# EAGLE schematic untitled (EAGLE 9.6.2)
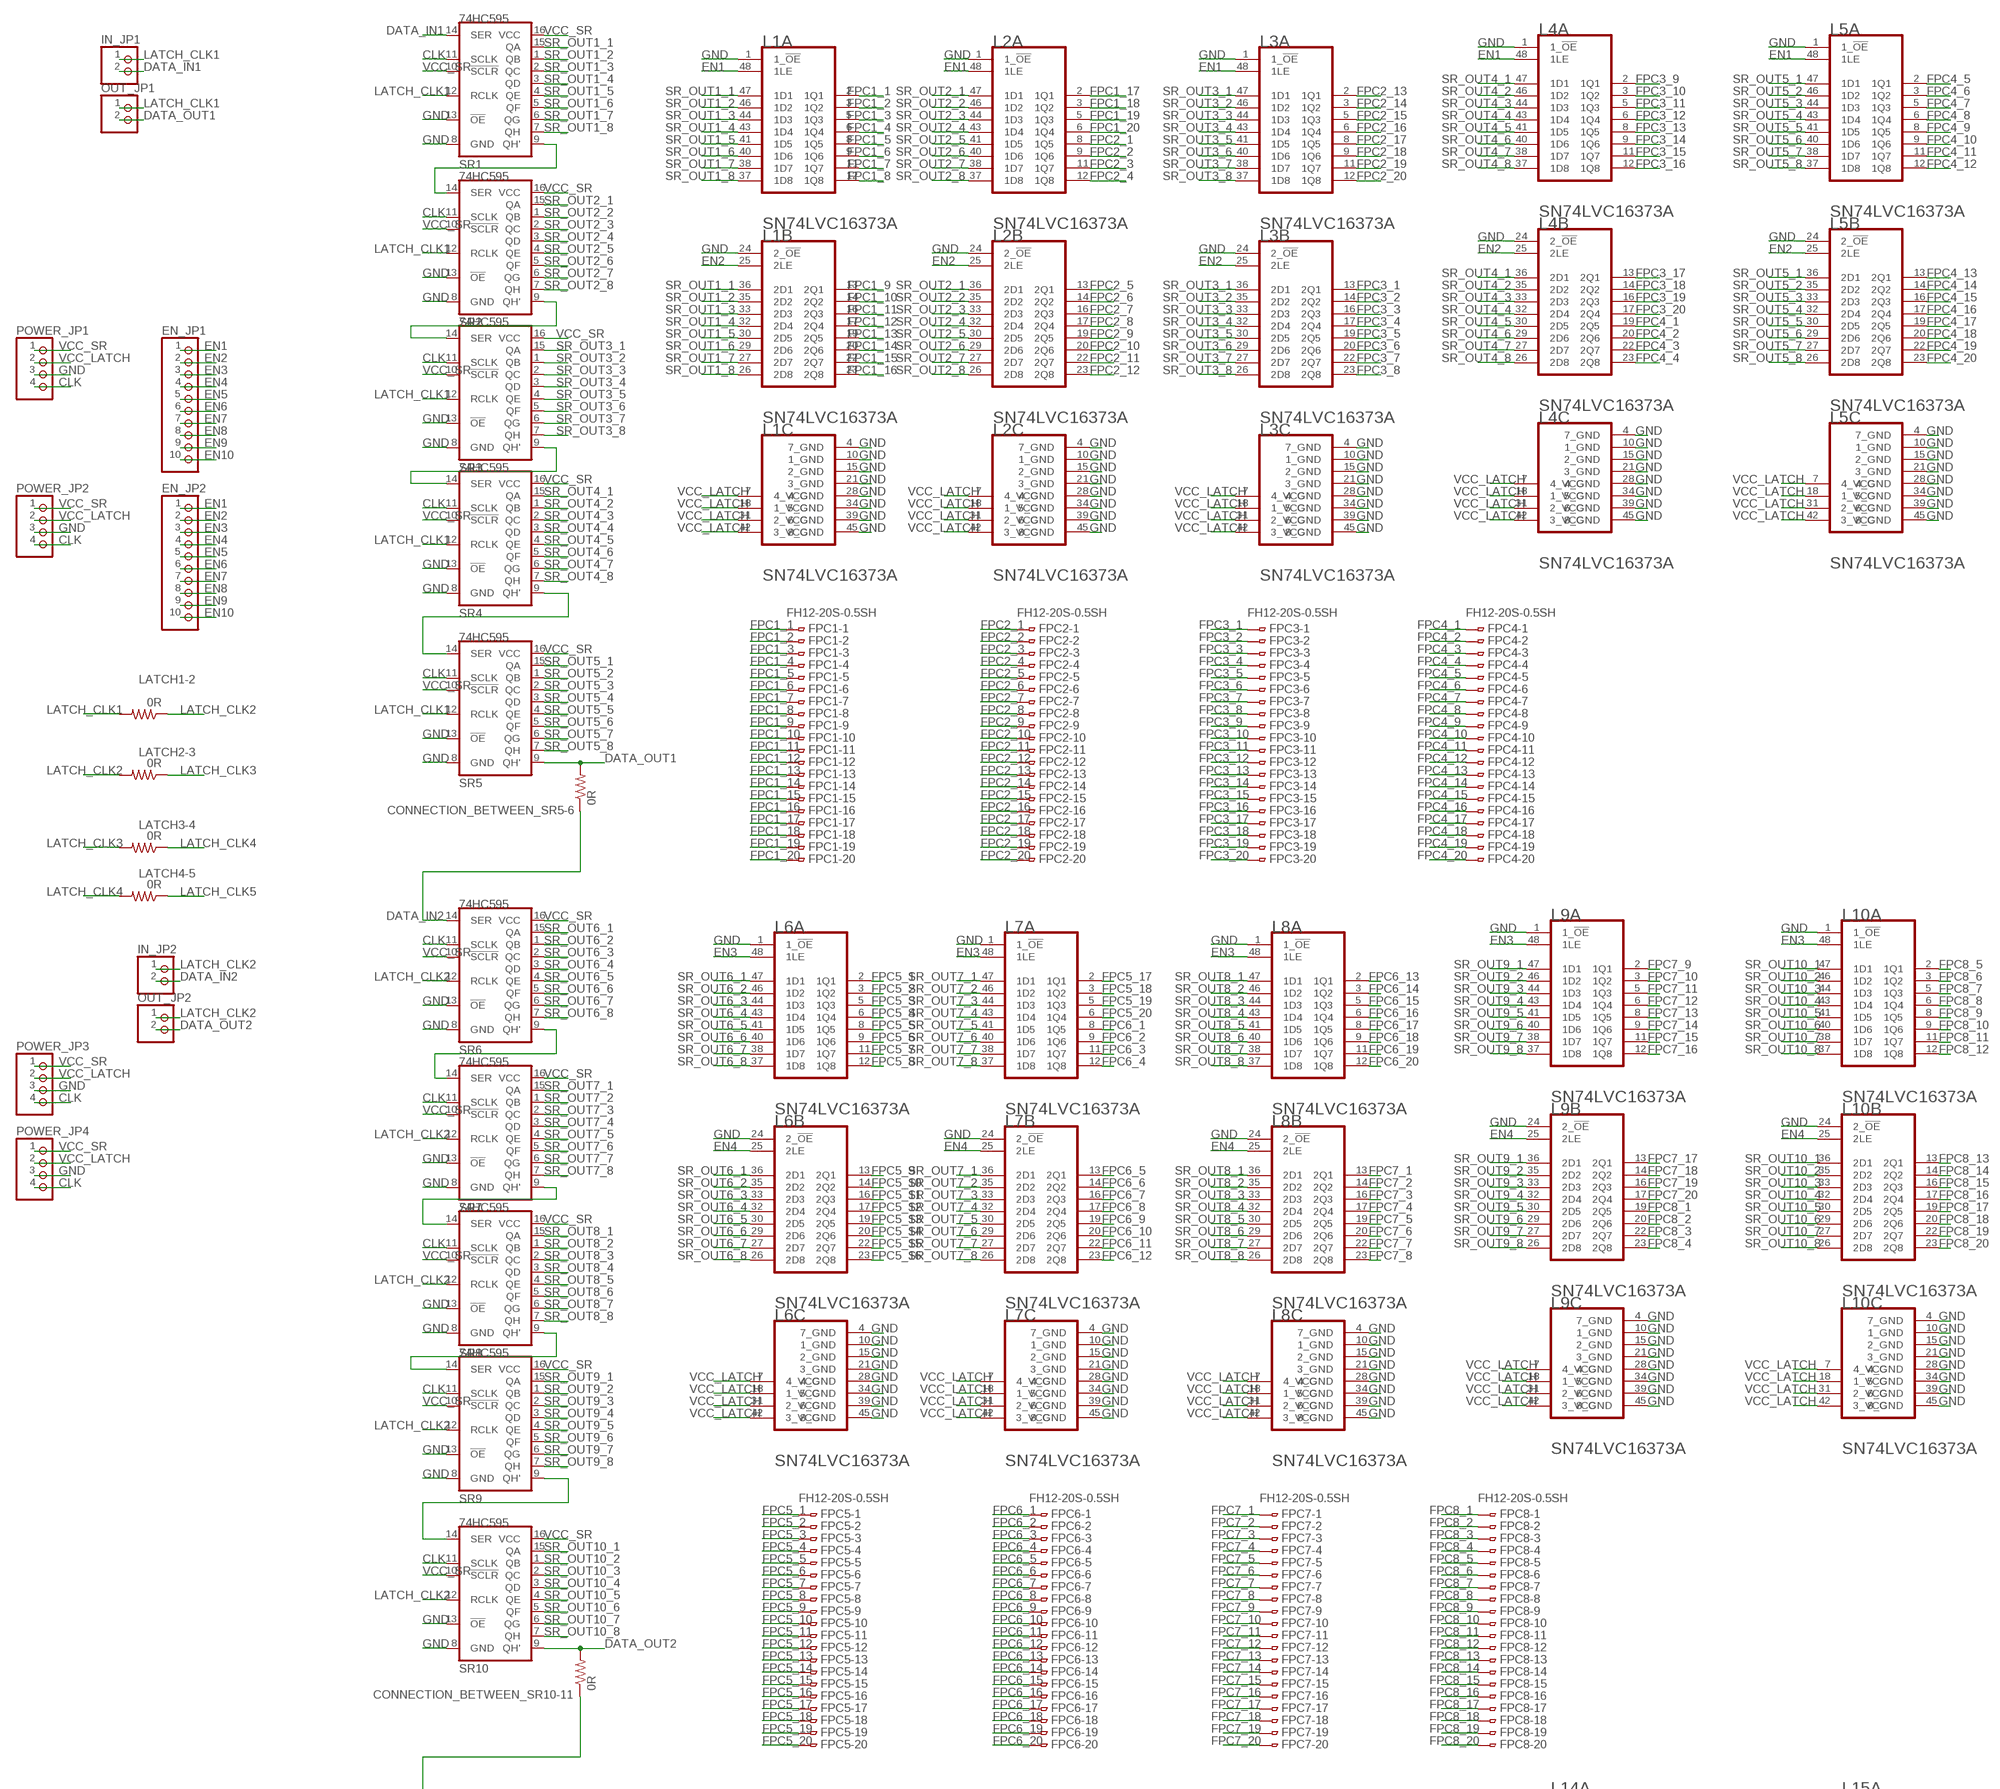
[diagram p0: schematic, sheet 1, part 1 of 3]
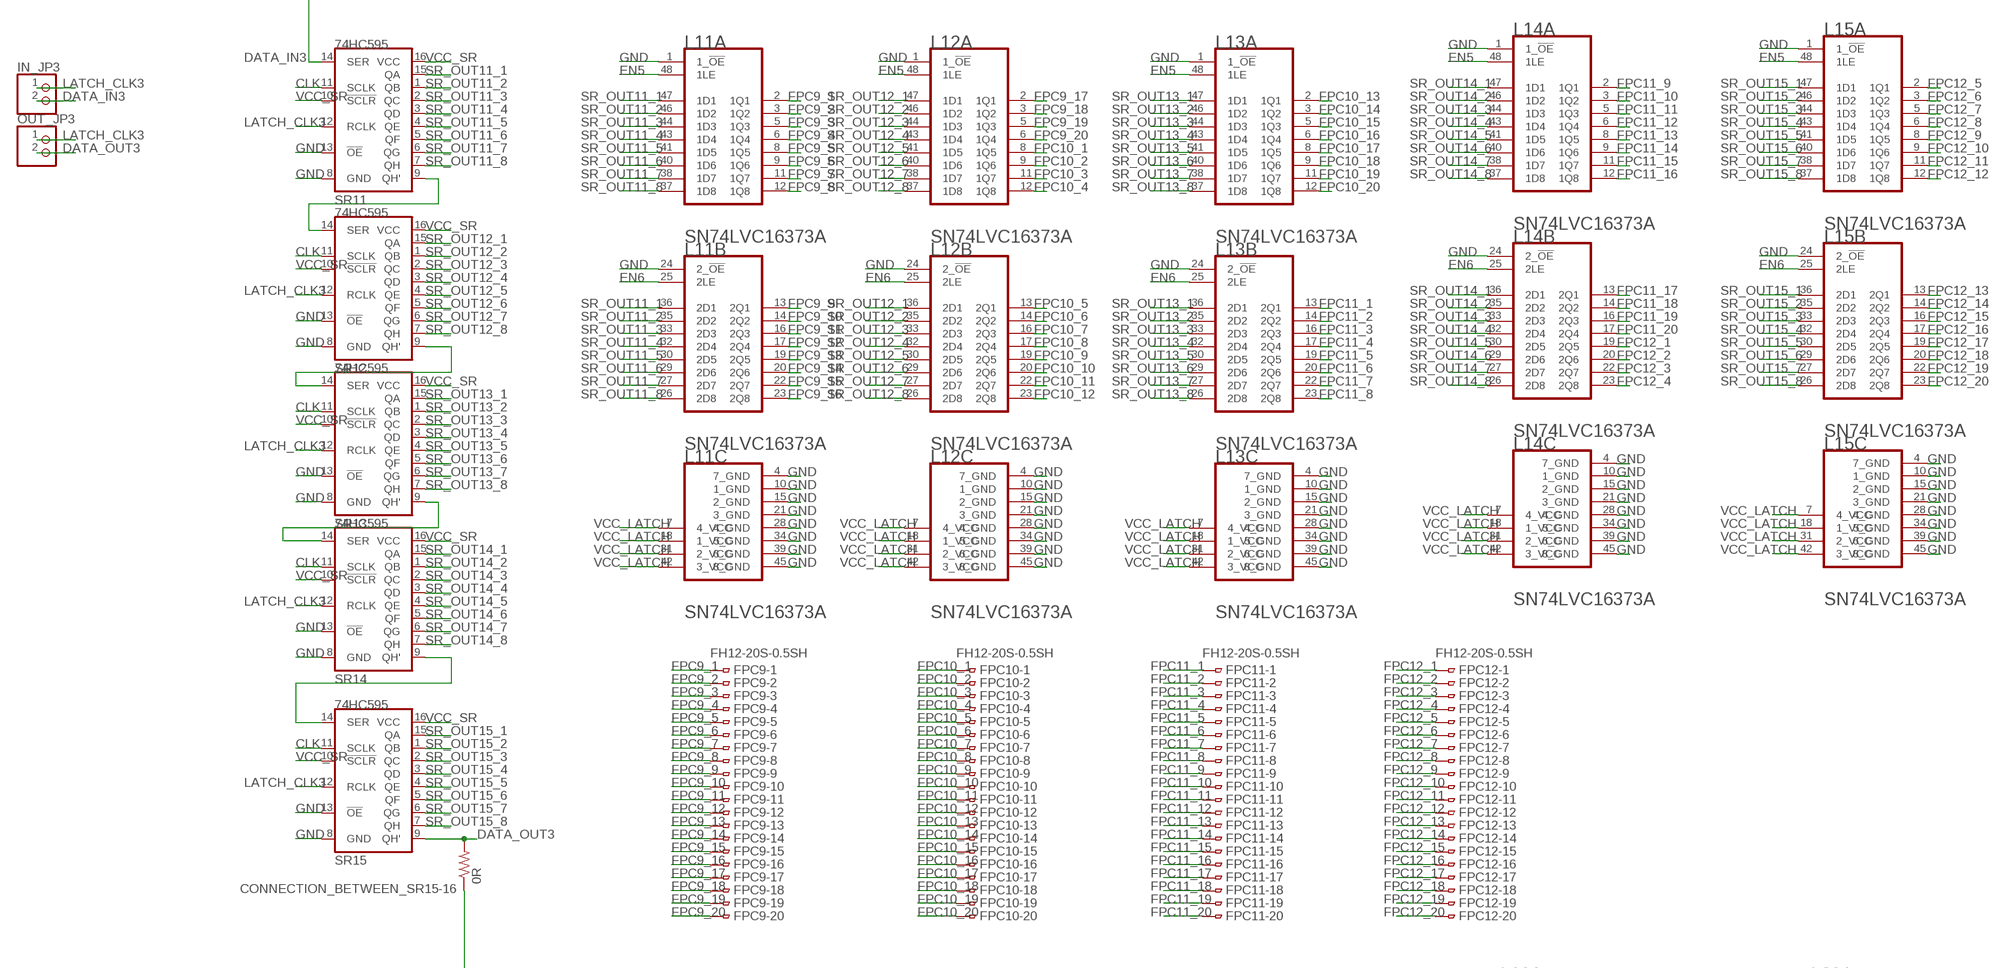
[diagram p1: schematic, sheet 1, part 2 of 3]
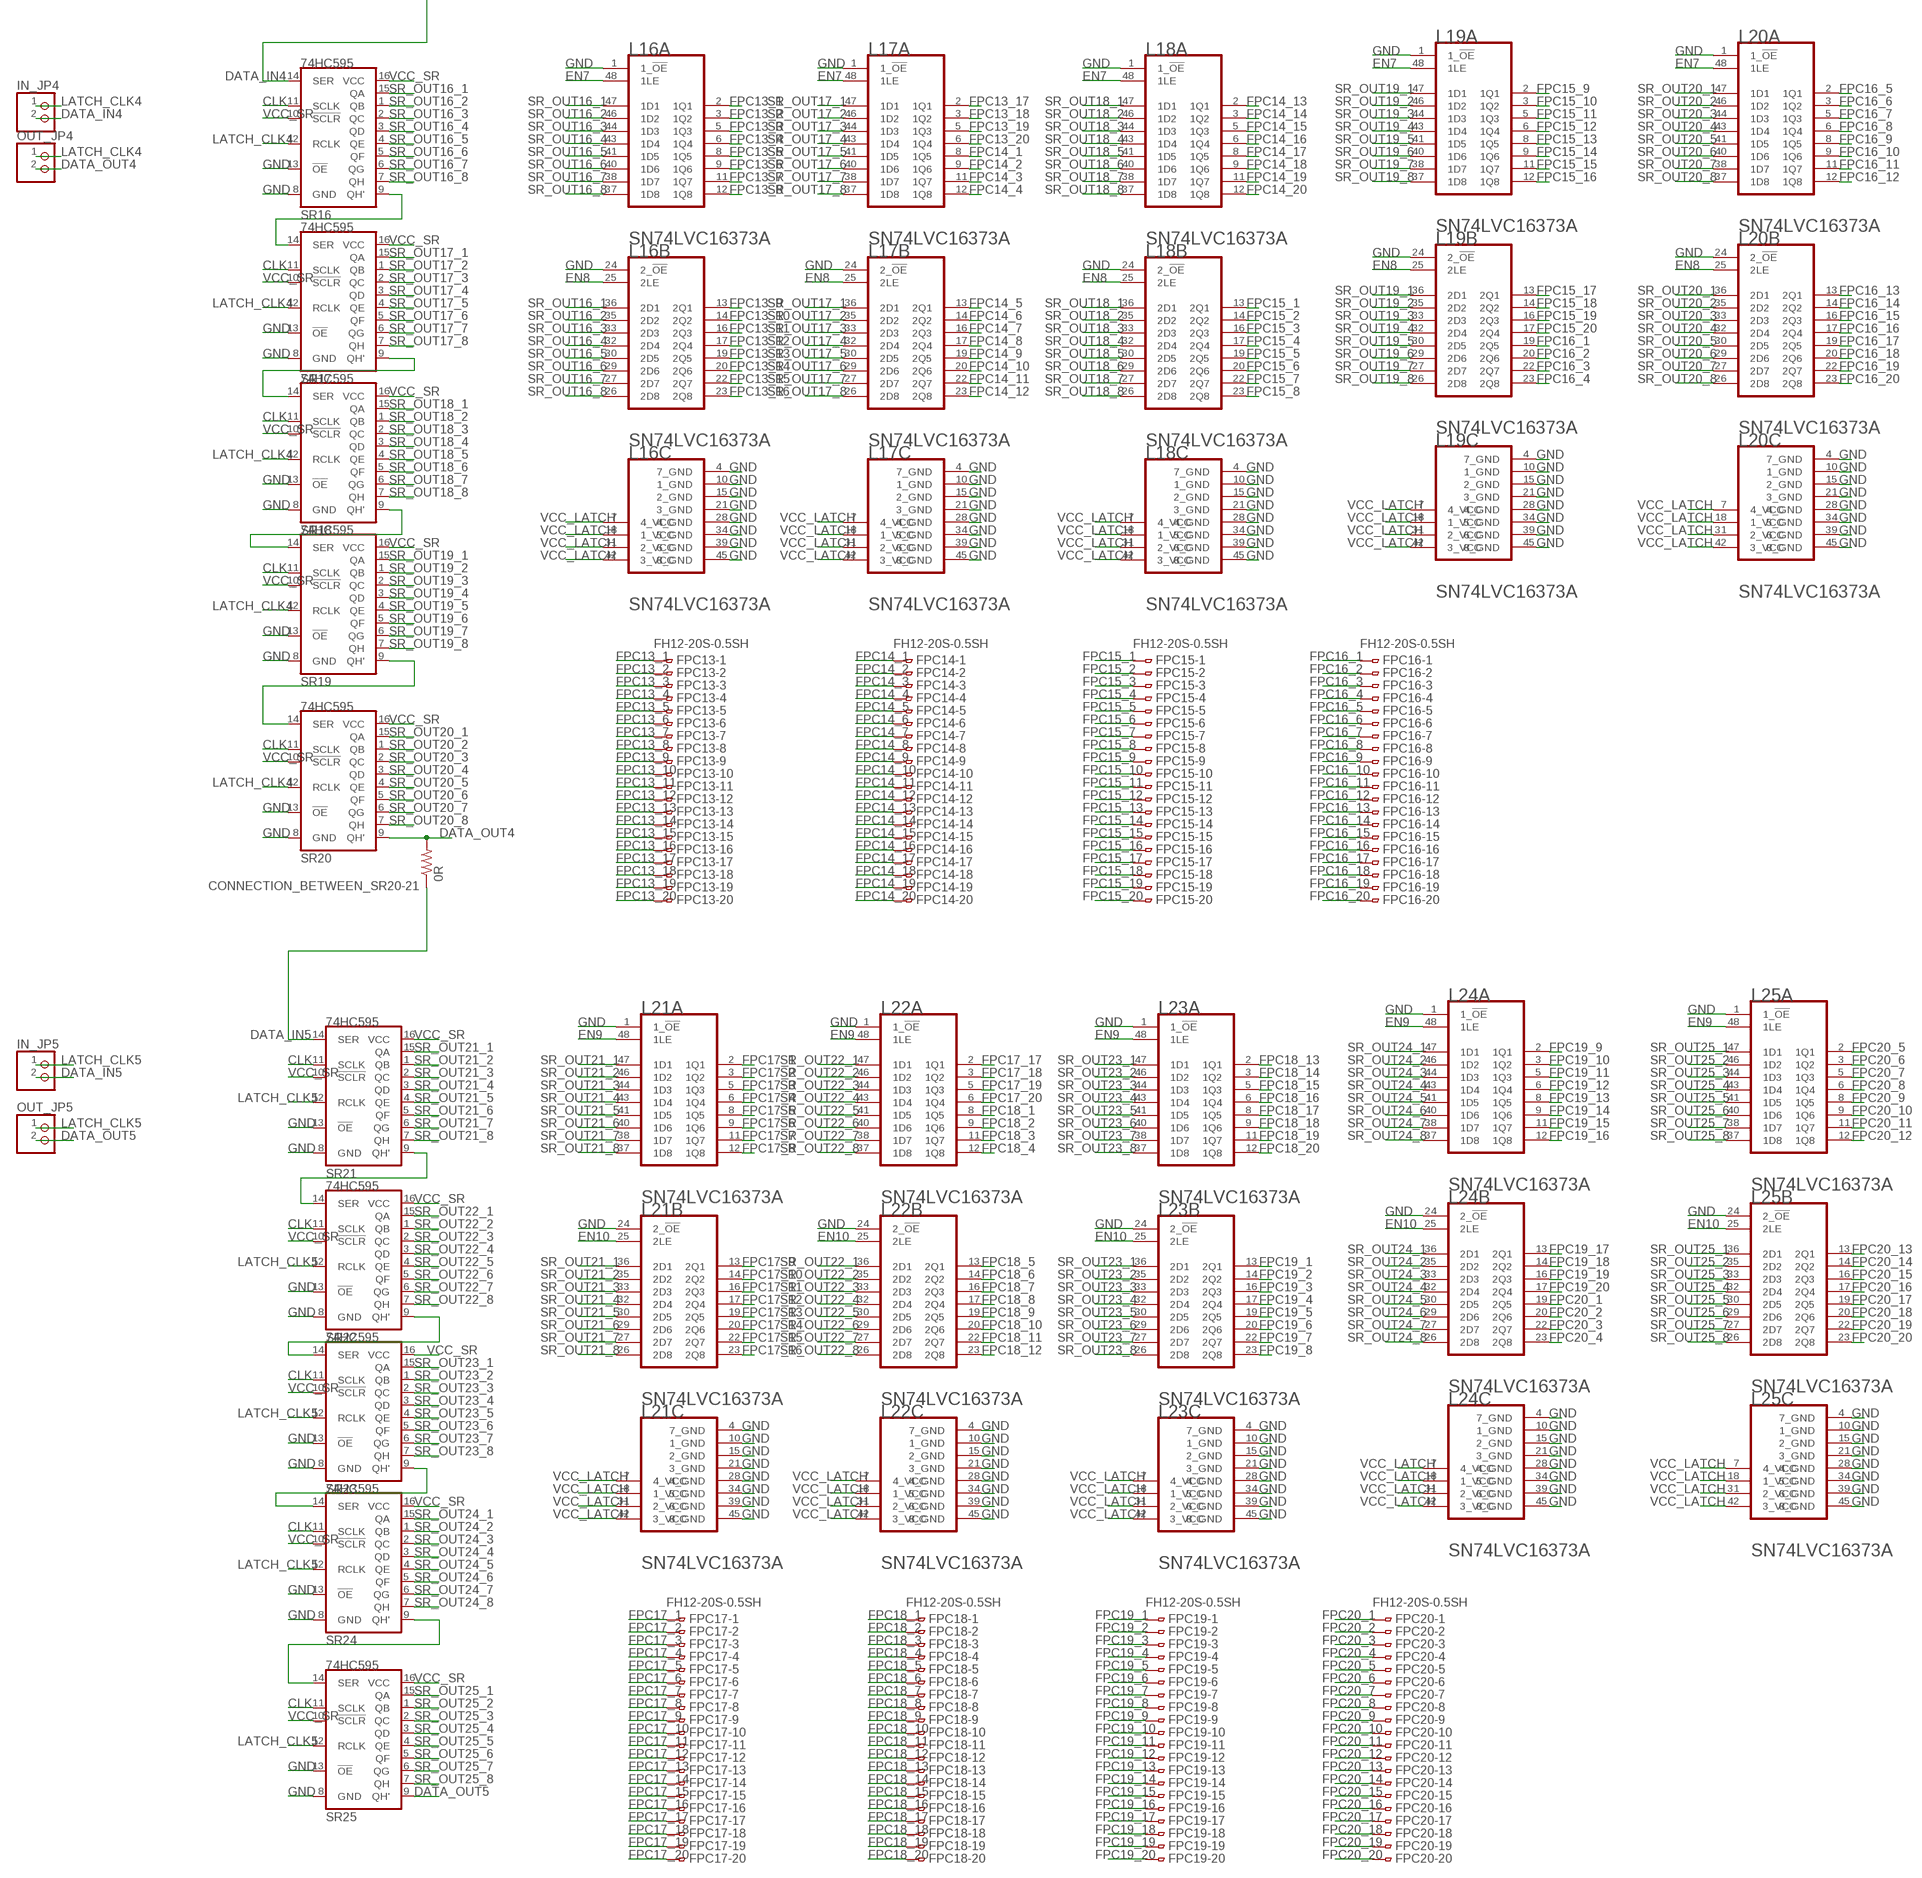
[diagram p2: schematic, sheet 1, part 3 of 3]

## Parts
CONNECTION_BETWEEN_SR5-6  0R  R-US_M0805  [M0805]
CONNECTION_BETWEEN_SR10-11  0R  R-US_M0805  [M0805]
CONNECTION_BETWEEN_SR15-16  0R  R-US_M0805  [M0805]
CONNECTION_BETWEEN_SR20-21  0R  R-US_M0805  [M0805]
EN_JP1  PINHD-1X10  [1X10]
EN_JP2  PINHD-1X10  [1X10]
FPC1  FH12-20S-0.5SH  [FH12-20S-0.5SH]
FPC2  FH12-20S-0.5SH  [FH12-20S-0.5SH]
FPC3  FH12-20S-0.5SH  [FH12-20S-0.5SH]
FPC4  FH12-20S-0.5SH  [FH12-20S-0.5SH]
FPC5  FH12-20S-0.5SH  [FH12-20S-0.5SH]
FPC6  FH12-20S-0.5SH  [FH12-20S-0.5SH]
FPC7  FH12-20S-0.5SH  [FH12-20S-0.5SH]
FPC8  FH12-20S-0.5SH  [FH12-20S-0.5SH]
FPC9  FH12-20S-0.5SH  [FH12-20S-0.5SH]
FPC10  FH12-20S-0.5SH  [FH12-20S-0.5SH]
FPC11  FH12-20S-0.5SH  [FH12-20S-0.5SH]
FPC12  FH12-20S-0.5SH  [FH12-20S-0.5SH]
FPC13  FH12-20S-0.5SH  [FH12-20S-0.5SH]
FPC14  FH12-20S-0.5SH  [FH12-20S-0.5SH]
FPC15  FH12-20S-0.5SH  [FH12-20S-0.5SH]
FPC16  FH12-20S-0.5SH  [FH12-20S-0.5SH]
FPC17  FH12-20S-0.5SH  [FH12-20S-0.5SH]
FPC18  FH12-20S-0.5SH  [FH12-20S-0.5SH]
FPC19  FH12-20S-0.5SH  [FH12-20S-0.5SH]
FPC20  FH12-20S-0.5SH  [FH12-20S-0.5SH]
IN_JP1  PINHD-1X2  [1X02]
IN_JP2  PINHD-1X2  [1X02]
IN_JP3  PINHD-1X2  [1X02]
IN_JP4  PINHD-1X2  [1X02]
IN_JP5  PINHD-1X2  [1X02]
L1  TEXAS_INSTRUMENTS_SN74LVC16373ATEXAS_INSTRUMENTS_SN74LVC16373A_0_2  [TEXAS_INSTRUMENTS_SN74LVC16373A_2]
L2  TEXAS_INSTRUMENTS_SN74LVC16373ATEXAS_INSTRUMENTS_SN74LVC16373A_0_2  [TEXAS_INSTRUMENTS_SN74LVC16373A_2]
L3  TEXAS_INSTRUMENTS_SN74LVC16373ATEXAS_INSTRUMENTS_SN74LVC16373A_0_2  [TEXAS_INSTRUMENTS_SN74LVC16373A_2]
L4  TEXAS_INSTRUMENTS_SN74LVC16373ATEXAS_INSTRUMENTS_SN74LVC16373A_0_2  [TEXAS_INSTRUMENTS_SN74LVC16373A_2]
L5  TEXAS_INSTRUMENTS_SN74LVC16373ATEXAS_INSTRUMENTS_SN74LVC16373A_0_2  [TEXAS_INSTRUMENTS_SN74LVC16373A_2]
L6  TEXAS_INSTRUMENTS_SN74LVC16373ATEXAS_INSTRUMENTS_SN74LVC16373A_0_2  [TEXAS_INSTRUMENTS_SN74LVC16373A_2]
L7  TEXAS_INSTRUMENTS_SN74LVC16373ATEXAS_INSTRUMENTS_SN74LVC16373A_0_2  [TEXAS_INSTRUMENTS_SN74LVC16373A_2]
L8  TEXAS_INSTRUMENTS_SN74LVC16373ATEXAS_INSTRUMENTS_SN74LVC16373A_0_2  [TEXAS_INSTRUMENTS_SN74LVC16373A_2]
L9  TEXAS_INSTRUMENTS_SN74LVC16373ATEXAS_INSTRUMENTS_SN74LVC16373A_0_2  [TEXAS_INSTRUMENTS_SN74LVC16373A_2]
L10  TEXAS_INSTRUMENTS_SN74LVC16373ATEXAS_INSTRUMENTS_SN74LVC16373A_0_2  [TEXAS_INSTRUMENTS_SN74LVC16373A_2]
L11  TEXAS_INSTRUMENTS_SN74LVC16373ATEXAS_INSTRUMENTS_SN74LVC16373A_0_2  [TEXAS_INSTRUMENTS_SN74LVC16373A_2]
L12  TEXAS_INSTRUMENTS_SN74LVC16373ATEXAS_INSTRUMENTS_SN74LVC16373A_0_2  [TEXAS_INSTRUMENTS_SN74LVC16373A_2]
L13  TEXAS_INSTRUMENTS_SN74LVC16373ATEXAS_INSTRUMENTS_SN74LVC16373A_0_2  [TEXAS_INSTRUMENTS_SN74LVC16373A_2]
L14  TEXAS_INSTRUMENTS_SN74LVC16373ATEXAS_INSTRUMENTS_SN74LVC16373A_0_2  [TEXAS_INSTRUMENTS_SN74LVC16373A_2]
L15  TEXAS_INSTRUMENTS_SN74LVC16373ATEXAS_INSTRUMENTS_SN74LVC16373A_0_2  [TEXAS_INSTRUMENTS_SN74LVC16373A_2]
L16  TEXAS_INSTRUMENTS_SN74LVC16373ATEXAS_INSTRUMENTS_SN74LVC16373A_0_2  [TEXAS_INSTRUMENTS_SN74LVC16373A_2]
L17  TEXAS_INSTRUMENTS_SN74LVC16373ATEXAS_INSTRUMENTS_SN74LVC16373A_0_2  [TEXAS_INSTRUMENTS_SN74LVC16373A_2]
L18  TEXAS_INSTRUMENTS_SN74LVC16373ATEXAS_INSTRUMENTS_SN74LVC16373A_0_2  [TEXAS_INSTRUMENTS_SN74LVC16373A_2]
L19  TEXAS_INSTRUMENTS_SN74LVC16373ATEXAS_INSTRUMENTS_SN74LVC16373A_0_2  [TEXAS_INSTRUMENTS_SN74LVC16373A_2]
L20  TEXAS_INSTRUMENTS_SN74LVC16373ATEXAS_INSTRUMENTS_SN74LVC16373A_0_2  [TEXAS_INSTRUMENTS_SN74LVC16373A_2]
L21  TEXAS_INSTRUMENTS_SN74LVC16373ATEXAS_INSTRUMENTS_SN74LVC16373A_0_2  [TEXAS_INSTRUMENTS_SN74LVC16373A_2]
L22  TEXAS_INSTRUMENTS_SN74LVC16373ATEXAS_INSTRUMENTS_SN74LVC16373A_0_2  [TEXAS_INSTRUMENTS_SN74LVC16373A_2]
L23  TEXAS_INSTRUMENTS_SN74LVC16373ATEXAS_INSTRUMENTS_SN74LVC16373A_0_2  [TEXAS_INSTRUMENTS_SN74LVC16373A_2]
L24  TEXAS_INSTRUMENTS_SN74LVC16373ATEXAS_INSTRUMENTS_SN74LVC16373A_0_2  [TEXAS_INSTRUMENTS_SN74LVC16373A_2]
L25  TEXAS_INSTRUMENTS_SN74LVC16373ATEXAS_INSTRUMENTS_SN74LVC16373A_0_2  [TEXAS_INSTRUMENTS_SN74LVC16373A_2]
LATCH1-2  0R  R-US_M0805  [M0805]
LATCH2-3  0R  R-US_M0805  [M0805]
LATCH3-4  0R  R-US_M0805  [M0805]
LATCH4-5  0R  R-US_M0805  [M0805]
OUT_JP1  PINHD-1X2  [1X02]
OUT_JP2  PINHD-1X2  [1X02]
OUT_JP3  PINHD-1X2  [1X02]
OUT_JP4  PINHD-1X2  [1X02]
OUT_JP5  PINHD-1X2  [1X02]
POWER_JP1  PINHD-1X4  [1X04]
POWER_JP2  PINHD-1X4  [1X04]
POWER_JP3  PINHD-1X4  [1X04]
POWER_JP4  PINHD-1X4  [1X04]
SR1  74HC595  [SO16]
SR2  74HC595  [SO16]
SR3  74HC595  [SO16]
SR4  74HC595  [SO16]
SR5  74HC595  [SO16]
SR6  74HC595  [SO16]
SR7  74HC595  [SO16]
SR8  74HC595  [SO16]
SR9  74HC595  [SO16]
SR10  74HC595  [SO16]
SR11  74HC595  [SO16]
SR12  74HC595  [SO16]
SR13  74HC595  [SO16]
SR14  74HC595  [SO16]
SR15  74HC595  [SO16]
SR16  74HC595  [SO16]
SR17  74HC595  [SO16]
SR18  74HC595  [SO16]
SR19  74HC595  [SO16]
SR20  74HC595  [SO16]
SR21  74HC595  [SO16]
SR22  74HC595  [SO16]
SR23  74HC595  [SO16]
SR24  74HC595  [SO16]
SR25  74HC595  [SO16]

## Nets
CLK: POWER_JP1.4 POWER_JP2.4 POWER_JP3.4 POWER_JP4.4 SR1.11(SCLK) SR2.11(SCLK) SR3.11(SCLK) SR4.11(SCLK) SR5.11(SCLK) SR6.11(SCLK) SR7.11(SCLK) SR8.11(SCLK) SR9.11(SCLK) SR10.11(SCLK) SR11.11(SCLK) SR12.11(SCLK) SR13.11(SCLK) SR14.11(SCLK) SR15.11(SCLK) SR16.11(SCLK) SR17.11(SCLK) SR18.11(SCLK) SR19.11(SCLK) SR20.11(SCLK) SR21.11(SCLK) SR22.11(SCLK) SR23.11(SCLK) SR24.11(SCLK) SR25.11(SCLK)
DATA_IN1: IN_JP1.2 SR1.14(SER)
DATA_IN2: CONNECTION_BETWEEN_SR5-6.1 IN_JP2.2 SR6.14(SER)
DATA_IN3: CONNECTION_BETWEEN_SR10-11.1 IN_JP3.2 SR11.14(SER)
DATA_IN4: CONNECTION_BETWEEN_SR15-16.1 IN_JP4.2 SR16.14(SER)
DATA_IN5: CONNECTION_BETWEEN_SR20-21.1 IN_JP5.2 SR21.14(SER)
DATA_OUT1: CONNECTION_BETWEEN_SR5-6.2 OUT_JP1.2 SR5.9(QH')
DATA_OUT2: CONNECTION_BETWEEN_SR10-11.2 OUT_JP2.2 SR10.9(QH')
DATA_OUT3: CONNECTION_BETWEEN_SR15-16.2 OUT_JP3.2 SR15.9(QH')
DATA_OUT4: CONNECTION_BETWEEN_SR20-21.2 OUT_JP4.2 SR20.9(QH')
DATA_OUT5: OUT_JP5.2 SR25.9(QH')
EN1: EN_JP1.1 EN_JP2.1 L1.48(A:1LE) L2.48(A:1LE) L3.48(A:1LE) L4.48(A:1LE) L5.48(A:1LE)
EN2: EN_JP1.2 EN_JP2.2 L1.25(B:2LE) L2.25(B:2LE) L3.25(B:2LE) L4.25(B:2LE) L5.25(B:2LE)
EN3: EN_JP1.3 EN_JP2.3 L6.48(A:1LE) L7.48(A:1LE) L8.48(A:1LE) L9.48(A:1LE) L10.48(A:1LE)
EN4: EN_JP1.4 EN_JP2.4 L6.25(B:2LE) L7.25(B:2LE) L8.25(B:2LE) L9.25(B:2LE) L10.25(B:2LE)
EN5: EN_JP1.5 EN_JP2.5 L11.48(A:1LE) L12.48(A:1LE) L13.48(A:1LE) L14.48(A:1LE) L15.48(A:1LE)
EN6: EN_JP1.6 EN_JP2.6 L11.25(B:2LE) L12.25(B:2LE) L13.25(B:2LE) L14.25(B:2LE) L15.25(B:2LE)
EN7: EN_JP1.7 EN_JP2.7 L16.48(A:1LE) L17.48(A:1LE) L18.48(A:1LE) L19.48(A:1LE) L20.48(A:1LE)
EN8: EN_JP1.8 EN_JP2.8 L16.25(B:2LE) L17.25(B:2LE) L18.25(B:2LE) L19.25(B:2LE) L20.25(B:2LE)
EN9: EN_JP1.9 EN_JP2.9 L21.48(A:1LE) L22.48(A:1LE) L23.48(A:1LE) L24.48(A:1LE) L25.48(A:1LE)
EN10: EN_JP1.10 EN_JP2.10 L21.25(B:2LE) L22.25(B:2LE) L23.25(B:2LE) L24.25(B:2LE) L25.25(B:2LE)
FPC1_1: FPC1.1 L1.2(A:1Q1)
FPC1_2: FPC1.2 L1.3(A:1Q2)
FPC1_3: FPC1.3 L1.5(A:1Q3)
FPC1_4: FPC1.4 L1.6(A:1Q4)
FPC1_5: FPC1.5 L1.8(A:1Q5)
FPC1_6: FPC1.6 L1.9(A:1Q6)
FPC1_7: FPC1.7 L1.11(A:1Q7)
FPC1_8: FPC1.8 L1.12(A:1Q8)
FPC1_9: FPC1.9 L1.13(B:2Q1)
FPC1_10: FPC1.10 L1.14(B:2Q2)
FPC1_11: FPC1.11 L1.16(B:2Q3)
FPC1_12: FPC1.12 L1.17(B:2Q4)
FPC1_13: FPC1.13 L1.19(B:2Q5)
FPC1_14: FPC1.14 L1.20(B:2Q6)
FPC1_15: FPC1.15 L1.22(B:2Q7)
FPC1_16: FPC1.16 L1.23(B:2Q8)
FPC1_17: FPC1.17 L2.2(A:1Q1)
FPC1_18: FPC1.18 L2.3(A:1Q2)
FPC1_19: FPC1.19 L2.5(A:1Q3)
FPC1_20: FPC1.20 L2.6(A:1Q4)
FPC2_1: FPC2.1 L2.8(A:1Q5)
FPC2_2: FPC2.2 L2.9(A:1Q6)
FPC2_3: FPC2.3 L2.11(A:1Q7)
FPC2_4: FPC2.4 L2.12(A:1Q8)
FPC2_5: FPC2.5 L2.13(B:2Q1)
FPC2_6: FPC2.6 L2.14(B:2Q2)
FPC2_7: FPC2.7 L2.16(B:2Q3)
FPC2_8: FPC2.8 L2.17(B:2Q4)
FPC2_9: FPC2.9 L2.19(B:2Q5)
FPC2_10: FPC2.10 L2.20(B:2Q6)
FPC2_11: FPC2.11 L2.22(B:2Q7)
FPC2_12: FPC2.12 L2.23(B:2Q8)
FPC2_13: FPC2.13 L3.2(A:1Q1)
FPC2_14: FPC2.14 L3.3(A:1Q2)
FPC2_15: FPC2.15 L3.5(A:1Q3)
FPC2_16: FPC2.16 L3.6(A:1Q4)
FPC2_17: FPC2.17 L3.8(A:1Q5)
FPC2_18: FPC2.18 L3.9(A:1Q6)
FPC2_19: FPC2.19 L3.11(A:1Q7)
FPC2_20: FPC2.20 L3.12(A:1Q8)
FPC3_1: FPC3.1 L3.13(B:2Q1)
FPC3_2: FPC3.2 L3.14(B:2Q2)
FPC3_3: FPC3.3 L3.16(B:2Q3)
FPC3_4: FPC3.4 L3.17(B:2Q4)
FPC3_5: FPC3.5 L3.19(B:2Q5)
FPC3_6: FPC3.6 L3.20(B:2Q6)
FPC3_7: FPC3.7 L3.22(B:2Q7)
FPC3_8: FPC3.8 L3.23(B:2Q8)
FPC3_9: FPC3.9 L4.2(A:1Q1)
FPC3_10: FPC3.10 L4.3(A:1Q2)
FPC3_11: FPC3.11 L4.5(A:1Q3)
FPC3_12: FPC3.12 L4.6(A:1Q4)
FPC3_13: FPC3.13 L4.8(A:1Q5)
FPC3_14: FPC3.14 L4.9(A:1Q6)
FPC3_15: FPC3.15 L4.11(A:1Q7)
FPC3_16: FPC3.16 L4.12(A:1Q8)
FPC3_17: FPC3.17 L4.13(B:2Q1)
FPC3_18: FPC3.18 L4.14(B:2Q2)
FPC3_19: FPC3.19 L4.16(B:2Q3)
FPC3_20: FPC3.20 L4.17(B:2Q4)
FPC4_1: FPC4.1 L4.19(B:2Q5)
FPC4_2: FPC4.2 L4.20(B:2Q6)
FPC4_3: FPC4.3 L4.22(B:2Q7)
FPC4_4: FPC4.4 L4.23(B:2Q8)
FPC4_5: FPC4.5 L5.2(A:1Q1)
FPC4_6: FPC4.6 L5.3(A:1Q2)
FPC4_7: FPC4.7 L5.5(A:1Q3)
FPC4_8: FPC4.8 L5.6(A:1Q4)
FPC4_9: FPC4.9 L5.8(A:1Q5)
FPC4_10: FPC4.10 L5.9(A:1Q6)
FPC4_11: FPC4.11 L5.11(A:1Q7)
FPC4_12: FPC4.12 L5.12(A:1Q8)
FPC4_13: FPC4.13 L5.13(B:2Q1)
FPC4_14: FPC4.14 L5.14(B:2Q2)
FPC4_15: FPC4.15 L5.16(B:2Q3)
FPC4_16: FPC4.16 L5.17(B:2Q4)
FPC4_17: FPC4.17 L5.19(B:2Q5)
FPC4_18: FPC4.18 L5.20(B:2Q6)
FPC4_19: FPC4.19 L5.22(B:2Q7)
FPC4_20: FPC4.20 L5.23(B:2Q8)
FPC5_1: FPC5.1 L6.2(A:1Q1)
FPC5_2: FPC5.2 L6.3(A:1Q2)
FPC5_3: FPC5.3 L6.5(A:1Q3)
FPC5_4: FPC5.4 L6.6(A:1Q4)
FPC5_5: FPC5.5 L6.8(A:1Q5)
FPC5_6: FPC5.6 L6.9(A:1Q6)
FPC5_7: FPC5.7 L6.11(A:1Q7)
FPC5_8: FPC5.8 L6.12(A:1Q8)
FPC5_9: FPC5.9 L6.13(B:2Q1)
FPC5_10: FPC5.10 L6.14(B:2Q2)
FPC5_11: FPC5.11 L6.16(B:2Q3)
FPC5_12: FPC5.12 L6.17(B:2Q4)
FPC5_13: FPC5.13 L6.19(B:2Q5)
FPC5_14: FPC5.14 L6.20(B:2Q6)
FPC5_15: FPC5.15 L6.22(B:2Q7)
FPC5_16: FPC5.16 L6.23(B:2Q8)
FPC5_17: FPC5.17 L7.2(A:1Q1)
FPC5_18: FPC5.18 L7.3(A:1Q2)
FPC5_19: FPC5.19 L7.5(A:1Q3)
FPC5_20: FPC5.20 L7.6(A:1Q4)
FPC6_1: FPC6.1 L7.8(A:1Q5)
FPC6_2: FPC6.2 L7.9(A:1Q6)
FPC6_3: FPC6.3 L7.11(A:1Q7)
FPC6_4: FPC6.4 L7.12(A:1Q8)
FPC6_5: FPC6.5 L7.13(B:2Q1)
FPC6_6: FPC6.6 L7.14(B:2Q2)
FPC6_7: FPC6.7 L7.16(B:2Q3)
FPC6_8: FPC6.8 L7.17(B:2Q4)
FPC6_9: FPC6.9 L7.19(B:2Q5)
FPC6_10: FPC6.10 L7.20(B:2Q6)
FPC6_11: FPC6.11 L7.22(B:2Q7)
FPC6_12: FPC6.12 L7.23(B:2Q8)
FPC6_13: FPC6.13 L8.2(A:1Q1)
FPC6_14: FPC6.14 L8.3(A:1Q2)
FPC6_15: FPC6.15 L8.5(A:1Q3)
FPC6_16: FPC6.16 L8.6(A:1Q4)
FPC6_17: FPC6.17 L8.8(A:1Q5)
FPC6_18: FPC6.18 L8.9(A:1Q6)
FPC6_19: FPC6.19 L8.11(A:1Q7)
FPC6_20: FPC6.20 L8.12(A:1Q8)
FPC7_1: FPC7.1 L8.13(B:2Q1)
FPC7_2: FPC7.2 L8.14(B:2Q2)
FPC7_3: FPC7.3 L8.16(B:2Q3)
FPC7_4: FPC7.4 L8.17(B:2Q4)
FPC7_5: FPC7.5 L8.19(B:2Q5)
FPC7_6: FPC7.6 L8.20(B:2Q6)
FPC7_7: FPC7.7 L8.22(B:2Q7)
FPC7_8: FPC7.8 L8.23(B:2Q8)
FPC7_9: FPC7.9 L9.2(A:1Q1)
FPC7_10: FPC7.10 L9.3(A:1Q2)
FPC7_11: FPC7.11 L9.5(A:1Q3)
FPC7_12: FPC7.12 L9.6(A:1Q4)
FPC7_13: FPC7.13 L9.8(A:1Q5)
FPC7_14: FPC7.14 L9.9(A:1Q6)
FPC7_15: FPC7.15 L9.11(A:1Q7)
FPC7_16: FPC7.16 L9.12(A:1Q8)
FPC7_17: FPC7.17 L9.13(B:2Q1)
FPC7_18: FPC7.18 L9.14(B:2Q2)
FPC7_19: FPC7.19 L9.16(B:2Q3)
FPC7_20: FPC7.20 L9.17(B:2Q4)
FPC8_1: FPC8.1 L9.19(B:2Q5)
FPC8_2: FPC8.2 L9.20(B:2Q6)
FPC8_3: FPC8.3 L9.22(B:2Q7)
FPC8_4: FPC8.4 L9.23(B:2Q8)
FPC8_5: FPC8.5 L10.2(A:1Q1)
FPC8_6: FPC8.6 L10.3(A:1Q2)
FPC8_7: FPC8.7 L10.5(A:1Q3)
FPC8_8: FPC8.8 L10.6(A:1Q4)
FPC8_9: FPC8.9 L10.8(A:1Q5)
FPC8_10: FPC8.10 L10.9(A:1Q6)
FPC8_11: FPC8.11 L10.11(A:1Q7)
FPC8_12: FPC8.12 L10.12(A:1Q8)
FPC8_13: FPC8.13 L10.13(B:2Q1)
FPC8_14: FPC8.14 L10.14(B:2Q2)
FPC8_15: FPC8.15 L10.16(B:2Q3)
FPC8_16: FPC8.16 L10.17(B:2Q4)
FPC8_17: FPC8.17 L10.19(B:2Q5)
FPC8_18: FPC8.18 L10.20(B:2Q6)
FPC8_19: FPC8.19 L10.22(B:2Q7)
FPC8_20: FPC8.20 L10.23(B:2Q8)
FPC9_1: FPC9.1 L11.2(A:1Q1)
FPC9_2: FPC9.2 L11.3(A:1Q2)
FPC9_3: FPC9.3 L11.5(A:1Q3)
FPC9_4: FPC9.4 L11.6(A:1Q4)
FPC9_5: FPC9.5 L11.8(A:1Q5)
FPC9_6: FPC9.6 L11.9(A:1Q6)
FPC9_7: FPC9.7 L11.11(A:1Q7)
FPC9_8: FPC9.8 L11.12(A:1Q8)
FPC9_9: FPC9.9 L11.13(B:2Q1)
FPC9_10: FPC9.10 L11.14(B:2Q2)
FPC9_11: FPC9.11 L11.16(B:2Q3)
FPC9_12: FPC9.12 L11.17(B:2Q4)
FPC9_13: FPC9.13 L11.19(B:2Q5)
FPC9_14: FPC9.14 L11.20(B:2Q6)
FPC9_15: FPC9.15 L11.22(B:2Q7)
FPC9_16: FPC9.16 L11.23(B:2Q8)
FPC9_17: FPC9.17 L12.2(A:1Q1)
FPC9_18: FPC9.18 L12.3(A:1Q2)
FPC9_19: FPC9.19 L12.5(A:1Q3)
FPC9_20: FPC9.20 L12.6(A:1Q4)
FPC10_1: FPC10.1 L12.8(A:1Q5)
FPC10_2: FPC10.2 L12.9(A:1Q6)
FPC10_3: FPC10.3 L12.11(A:1Q7)
FPC10_4: FPC10.4 L12.12(A:1Q8)
FPC10_5: FPC10.5 L12.13(B:2Q1)
FPC10_6: FPC10.6 L12.14(B:2Q2)
FPC10_7: FPC10.7 L12.16(B:2Q3)
FPC10_8: FPC10.8 L12.17(B:2Q4)
FPC10_9: FPC10.9 L12.19(B:2Q5)
FPC10_10: FPC10.10 L12.20(B:2Q6)
FPC10_11: FPC10.11 L12.22(B:2Q7)
FPC10_12: FPC10.12 L12.23(B:2Q8)
FPC10_13: FPC10.13 L13.2(A:1Q1)
FPC10_14: FPC10.14 L13.3(A:1Q2)
FPC10_15: FPC10.15 L13.5(A:1Q3)
FPC10_16: FPC10.16 L13.6(A:1Q4)
FPC10_17: FPC10.17 L13.8(A:1Q5)
FPC10_18: FPC10.18 L13.9(A:1Q6)
FPC10_19: FPC10.19 L13.11(A:1Q7)
FPC10_20: FPC10.20 L13.12(A:1Q8)
FPC11_1: FPC11.1 L13.13(B:2Q1)
FPC11_2: FPC11.2 L13.14(B:2Q2)
FPC11_3: FPC11.3 L13.16(B:2Q3)
FPC11_4: FPC11.4 L13.17(B:2Q4)
FPC11_5: FPC11.5 L13.19(B:2Q5)
FPC11_6: FPC11.6 L13.20(B:2Q6)
FPC11_7: FPC11.7 L13.22(B:2Q7)
FPC11_8: FPC11.8 L13.23(B:2Q8)
FPC11_9: FPC11.9 L14.2(A:1Q1)
FPC11_10: FPC11.10 L14.3(A:1Q2)
FPC11_11: FPC11.11 L14.5(A:1Q3)
FPC11_12: FPC11.12 L14.6(A:1Q4)
FPC11_13: FPC11.13 L14.8(A:1Q5)
FPC11_14: FPC11.14 L14.9(A:1Q6)
FPC11_15: FPC11.15 L14.11(A:1Q7)
FPC11_16: FPC11.16 L14.12(A:1Q8)
FPC11_17: FPC11.17 L14.13(B:2Q1)
FPC11_18: FPC11.18 L14.14(B:2Q2)
FPC11_19: FPC11.19 L14.16(B:2Q3)
FPC11_20: FPC11.20 L14.17(B:2Q4)
FPC12_1: FPC12.1 L14.19(B:2Q5)
FPC12_2: FPC12.2 L14.20(B:2Q6)
FPC12_3: FPC12.3 L14.22(B:2Q7)
FPC12_4: FPC12.4 L14.23(B:2Q8)
FPC12_5: FPC12.5 L15.2(A:1Q1)
FPC12_6: FPC12.6 L15.3(A:1Q2)
FPC12_7: FPC12.7 L15.5(A:1Q3)
FPC12_8: FPC12.8 L15.6(A:1Q4)
FPC12_9: FPC12.9 L15.8(A:1Q5)
FPC12_10: FPC12.10 L15.9(A:1Q6)
FPC12_11: FPC12.11 L15.11(A:1Q7)
FPC12_12: FPC12.12 L15.12(A:1Q8)
FPC12_13: FPC12.13 L15.13(B:2Q1)
FPC12_14: FPC12.14 L15.14(B:2Q2)
FPC12_15: FPC12.15 L15.16(B:2Q3)
FPC12_16: FPC12.16 L15.17(B:2Q4)
FPC12_17: FPC12.17 L15.19(B:2Q5)
FPC12_18: FPC12.18 L15.20(B:2Q6)
FPC12_19: FPC12.19 L15.22(B:2Q7)
FPC12_20: FPC12.20 L15.23(B:2Q8)
FPC13_1: FPC13.1 L16.2(A:1Q1)
FPC13_2: FPC13.2 L16.3(A:1Q2)
FPC13_3: FPC13.3 L16.5(A:1Q3)
FPC13_4: FPC13.4 L16.6(A:1Q4)
FPC13_5: FPC13.5 L16.8(A:1Q5)
FPC13_6: FPC13.6 L16.9(A:1Q6)
FPC13_7: FPC13.7 L16.11(A:1Q7)
FPC13_8: FPC13.8 L16.12(A:1Q8)
FPC13_9: FPC13.9 L16.13(B:2Q1)
FPC13_10: FPC13.10 L16.14(B:2Q2)
FPC13_11: FPC13.11 L16.16(B:2Q3)
FPC13_12: FPC13.12 L16.17(B:2Q4)
FPC13_13: FPC13.13 L16.19(B:2Q5)
FPC13_14: FPC13.14 L16.20(B:2Q6)
FPC13_15: FPC13.15 L16.22(B:2Q7)
FPC13_16: FPC13.16 L16.23(B:2Q8)
FPC13_17: FPC13.17 L17.2(A:1Q1)
FPC13_18: FPC13.18 L17.3(A:1Q2)
FPC13_19: FPC13.19 L17.5(A:1Q3)
FPC13_20: FPC13.20 L17.6(A:1Q4)
FPC14_1: FPC14.1 L17.8(A:1Q5)
FPC14_2: FPC14.2 L17.9(A:1Q6)
FPC14_3: FPC14.3 L17.11(A:1Q7)
FPC14_4: FPC14.4 L17.12(A:1Q8)
FPC14_5: FPC14.5 L17.13(B:2Q1)
FPC14_6: FPC14.6 L17.14(B:2Q2)
FPC14_7: FPC14.7 L17.16(B:2Q3)
FPC14_8: FPC14.8 L17.17(B:2Q4)
FPC14_9: FPC14.9 L17.19(B:2Q5)
FPC14_10: FPC14.10 L17.20(B:2Q6)
FPC14_11: FPC14.11 L17.22(B:2Q7)
FPC14_12: FPC14.12 L17.23(B:2Q8)
FPC14_13: FPC14.13 L18.2(A:1Q1)
FPC14_14: FPC14.14 L18.3(A:1Q2)
FPC14_15: FPC14.15 L18.5(A:1Q3)
FPC14_16: FPC14.16 L18.6(A:1Q4)
FPC14_17: FPC14.17 L18.8(A:1Q5)
FPC14_18: FPC14.18 L18.9(A:1Q6)
FPC14_19: FPC14.19 L18.11(A:1Q7)
FPC14_20: FPC14.20 L18.12(A:1Q8)
FPC15_1: FPC15.1 L18.13(B:2Q1)
FPC15_2: FPC15.2 L18.14(B:2Q2)
FPC15_3: FPC15.3 L18.16(B:2Q3)
FPC15_4: FPC15.4 L18.17(B:2Q4)
FPC15_5: FPC15.5 L18.19(B:2Q5)
FPC15_6: FPC15.6 L18.20(B:2Q6)
FPC15_7: FPC15.7 L18.22(B:2Q7)
FPC15_8: FPC15.8 L18.23(B:2Q8)
FPC15_9: FPC15.9 L19.2(A:1Q1)
FPC15_10: FPC15.10 L19.3(A:1Q2)
FPC15_11: FPC15.11 L19.5(A:1Q3)
FPC15_12: FPC15.12 L19.6(A:1Q4)
FPC15_13: FPC15.13 L19.8(A:1Q5)
FPC15_14: FPC15.14 L19.9(A:1Q6)
FPC15_15: FPC15.15 L19.11(A:1Q7)
FPC15_16: FPC15.16 L19.12(A:1Q8)
FPC15_17: FPC15.17 L19.13(B:2Q1)
FPC15_18: FPC15.18 L19.14(B:2Q2)
FPC15_19: FPC15.19 L19.16(B:2Q3)
FPC15_20: FPC15.20 L19.17(B:2Q4)
FPC16_1: FPC16.1 L19.19(B:2Q5)
FPC16_2: FPC16.2 L19.20(B:2Q6)
FPC16_3: FPC16.3 L19.22(B:2Q7)
FPC16_4: FPC16.4 L19.23(B:2Q8)
FPC16_5: FPC16.5 L20.2(A:1Q1)
FPC16_6: FPC16.6 L20.3(A:1Q2)
FPC16_7: FPC16.7 L20.5(A:1Q3)
FPC16_8: FPC16.8 L20.6(A:1Q4)
FPC16_9: FPC16.9 L20.8(A:1Q5)
FPC16_10: FPC16.10 L20.9(A:1Q6)
FPC16_11: FPC16.11 L20.11(A:1Q7)
FPC16_12: FPC16.12 L20.12(A:1Q8)
FPC16_13: FPC16.13 L20.13(B:2Q1)
FPC16_14: FPC16.14 L20.14(B:2Q2)
FPC16_15: FPC16.15 L20.16(B:2Q3)
FPC16_16: FPC16.16 L20.17(B:2Q4)
FPC16_17: FPC16.17 L20.19(B:2Q5)
FPC16_18: FPC16.18 L20.20(B:2Q6)
FPC16_19: FPC16.19 L20.22(B:2Q7)
FPC16_20: FPC16.20 L20.23(B:2Q8)
FPC17_1: FPC17.1 L21.2(A:1Q1)
FPC17_2: FPC17.2 L21.3(A:1Q2)
FPC17_3: FPC17.3 L21.5(A:1Q3)
FPC17_4: FPC17.4 L21.6(A:1Q4)
FPC17_5: FPC17.5 L21.8(A:1Q5)
FPC17_6: FPC17.6 L21.9(A:1Q6)
FPC17_7: FPC17.7 L21.11(A:1Q7)
FPC17_8: FPC17.8 L21.12(A:1Q8)
FPC17_9: FPC17.9 L21.13(B:2Q1)
FPC17_10: FPC17.10 L21.14(B:2Q2)
FPC17_11: FPC17.11 L21.16(B:2Q3)
FPC17_12: FPC17.12 L21.17(B:2Q4)
FPC17_13: FPC17.13 L21.19(B:2Q5)
FPC17_14: FPC17.14 L21.20(B:2Q6)
FPC17_15: FPC17.15 L21.22(B:2Q7)
FPC17_16: FPC17.16 L21.23(B:2Q8)
FPC17_17: FPC17.17 L22.2(A:1Q1)
FPC17_18: FPC17.18 L22.3(A:1Q2)
FPC17_19: FPC17.19 L22.5(A:1Q3)
FPC17_20: FPC17.20 L22.6(A:1Q4)
FPC18_1: FPC18.1 L22.8(A:1Q5)
FPC18_2: FPC18.2 L22.9(A:1Q6)
FPC18_3: FPC18.3 L22.11(A:1Q7)
FPC18_4: FPC18.4 L22.12(A:1Q8)
FPC18_5: FPC18.5 L22.13(B:2Q1)
FPC18_6: FPC18.6 L22.14(B:2Q2)
FPC18_7: FPC18.7 L22.16(B:2Q3)
FPC18_8: FPC18.8 L22.17(B:2Q4)
FPC18_9: FPC18.9 L22.19(B:2Q5)
FPC18_10: FPC18.10 L22.20(B:2Q6)
FPC18_11: FPC18.11 L22.22(B:2Q7)
FPC18_12: FPC18.12 L22.23(B:2Q8)
FPC18_13: FPC18.13 L23.2(A:1Q1)
FPC18_14: FPC18.14 L23.3(A:1Q2)
FPC18_15: FPC18.15 L23.5(A:1Q3)
FPC18_16: FPC18.16 L23.6(A:1Q4)
FPC18_17: FPC18.17 L23.8(A:1Q5)
FPC18_18: FPC18.18 L23.9(A:1Q6)
FPC18_19: FPC18.19 L23.11(A:1Q7)
FPC18_20: FPC18.20 L23.12(A:1Q8)
FPC19_1: FPC19.1 L23.13(B:2Q1)
FPC19_2: FPC19.2 L23.14(B:2Q2)
FPC19_3: FPC19.3 L23.16(B:2Q3)
FPC19_4: FPC19.4 L23.17(B:2Q4)
FPC19_5: FPC19.5 L23.19(B:2Q5)
FPC19_6: FPC19.6 L23.20(B:2Q6)
FPC19_7: FPC19.7 L23.22(B:2Q7)
FPC19_8: FPC19.8 L23.23(B:2Q8)
FPC19_9: FPC19.9 L24.2(A:1Q1)
FPC19_10: FPC19.10 L24.3(A:1Q2)
FPC19_11: FPC19.11 L24.5(A:1Q3)
FPC19_12: FPC19.12 L24.6(A:1Q4)
FPC19_13: FPC19.13 L24.8(A:1Q5)
FPC19_14: FPC19.14 L24.9(A:1Q6)
FPC19_15: FPC19.15 L24.11(A:1Q7)
FPC19_16: FPC19.16 L24.12(A:1Q8)
FPC19_17: FPC19.17 L24.13(B:2Q1)
FPC19_18: FPC19.18 L24.14(B:2Q2)
FPC19_19: FPC19.19 L24.16(B:2Q3)
FPC19_20: FPC19.20 L24.17(B:2Q4)
FPC20_1: FPC20.1 L24.19(B:2Q5)
FPC20_2: FPC20.2 L24.20(B:2Q6)
FPC20_3: FPC20.3 L24.22(B:2Q7)
FPC20_4: FPC20.4 L24.23(B:2Q8)
FPC20_5: FPC20.5 L25.2(A:1Q1)
FPC20_6: FPC20.6 L25.3(A:1Q2)
FPC20_7: FPC20.7 L25.5(A:1Q3)
FPC20_8: FPC20.8 L25.6(A:1Q4)
FPC20_9: FPC20.9 L25.8(A:1Q5)
FPC20_10: FPC20.10 L25.9(A:1Q6)
FPC20_11: FPC20.11 L25.11(A:1Q7)
FPC20_12: FPC20.12 L25.12(A:1Q8)
FPC20_13: FPC20.13 L25.13(B:2Q1)
FPC20_14: FPC20.14 L25.14(B:2Q2)
FPC20_15: FPC20.15 L25.16(B:2Q3)
FPC20_16: FPC20.16 L25.17(B:2Q4)
FPC20_17: FPC20.17 L25.19(B:2Q5)
FPC20_18: FPC20.18 L25.20(B:2Q6)
FPC20_19: FPC20.19 L25.22(B:2Q7)
FPC20_20: FPC20.20 L25.23(B:2Q8)
GND: L1.1(A:1_!OE!) L1.4(C:7_GND) L1.10(C:1_GND) L1.15(C:2_GND) L1.21(C:3_GND) L1.24(B:2_!OE!) L1.28(C:4_GND) L1.34(C:5_GND) L1.39(C:6_GND) L1.45(C:8_GND) L2.1(A:1_!OE!) L2.4(C:7_GND) L2.10(C:1_GND) L2.15(C:2_GND) L2.21(C:3_GND) L2.24(B:2_!OE!) L2.28(C:4_GND) L2.34(C:5_GND) L2.39(C:6_GND) L2.45(C:8_GND) L3.1(A:1_!OE!) L3.4(C:7_GND) L3.10(C:1_GND) L3.15(C:2_GND) L3.21(C:3_GND) L3.24(B:2_!OE!) L3.28(C:4_GND) L3.34(C:5_GND) L3.39(C:6_GND) L3.45(C:8_GND) L4.1(A:1_!OE!) L4.4(C:7_GND) L4.10(C:1_GND) L4.15(C:2_GND) L4.21(C:3_GND) L4.24(B:2_!OE!) L4.28(C:4_GND) L4.34(C:5_GND) L4.39(C:6_GND) L4.45(C:8_GND) L5.1(A:1_!OE!) L5.4(C:7_GND) L5.10(C:1_GND) L5.15(C:2_GND) L5.21(C:3_GND) L5.24(B:2_!OE!) L5.28(C:4_GND) L5.34(C:5_GND) L5.39(C:6_GND) L5.45(C:8_GND) L6.1(A:1_!OE!) L6.4(C:7_GND) L6.10(C:1_GND) L6.15(C:2_GND) L6.21(C:3_GND) L6.24(B:2_!OE!) L6.28(C:4_GND) L6.34(C:5_GND) L6.39(C:6_GND) L6.45(C:8_GND) L7.1(A:1_!OE!) L7.4(C:7_GND) L7.10(C:1_GND) L7.15(C:2_GND) L7.21(C:3_GND) L7.24(B:2_!OE!) L7.28(C:4_GND) L7.34(C:5_GND) L7.39(C:6_GND) L7.45(C:8_GND) L8.1(A:1_!OE!) L8.4(C:7_GND) L8.10(C:1_GND) L8.15(C:2_GND) L8.21(C:3_GND) L8.24(B:2_!OE!) L8.28(C:4_GND) L8.34(C:5_GND) L8.39(C:6_GND) L8.45(C:8_GND) L9.1(A:1_!OE!) L9.4(C:7_GND) L9.10(C:1_GND) L9.15(C:2_GND) L9.21(C:3_GND) L9.24(B:2_!OE!) L9.28(C:4_GND) L9.34(C:5_GND) L9.39(C:6_GND) L9.45(C:8_GND) L10.1(A:1_!OE!) L10.4(C:7_GND) L10.10(C:1_GND) L10.15(C:2_GND) L10.21(C:3_GND) L10.24(B:2_!OE!) L10.28(C:4_GND) L10.34(C:5_GND) L10.39(C:6_GND) L10.45(C:8_GND) L11.1(A:1_!OE!) L11.4(C:7_GND) L11.10(C:1_GND) L11.15(C:2_GND) L11.21(C:3_GND) L11.24(B:2_!OE!) L11.28(C:4_GND) L11.34(C:5_GND) L11.39(C:6_GND) L11.45(C:8_GND) L12.1(A:1_!OE!) L12.4(C:7_GND) L12.10(C:1_GND) L12.15(C:2_GND) L12.21(C:3_GND) L12.24(B:2_!OE!) L12.28(C:4_GND) L12.34(C:5_GND) L12.39(C:6_GND) L12.45(C:8_GND) L13.1(A:1_!OE!) L13.4(C:7_GND) L13.10(C:1_GND) L13.15(C:2_GND) L13.21(C:3_GND) L13.24(B:2_!OE!) L13.28(C:4_GND) L13.34(C:5_GND) L13.39(C:6_GND) L13.45(C:8_GND) L14.1(A:1_!OE!) L14.4(C:7_GND) L14.10(C:1_GND) L14.15(C:2_GND) L14.21(C:3_GND) L14.24(B:2_!OE!) L14.28(C:4_GND) L14.34(C:5_GND) L14.39(C:6_GND) L14.45(C:8_GND) L15.1(A:1_!OE!) L15.4(C:7_GND) L15.10(C:1_GND) L15.15(C:2_GND) L15.21(C:3_GND) L15.24(B:2_!OE!) L15.28(C:4_GND) L15.34(C:5_GND) L15.39(C:6_GND) L15.45(C:8_GND) L16.1(A:1_!OE!) L16.4(C:7_GND) L16.10(C:1_GND) L16.15(C:2_GND) L16.21(C:3_GND) L16.24(B:2_!OE!) L16.28(C:4_GND) L16.34(C:5_GND) L16.39(C:6_GND) L16.45(C:8_GND) L17.1(A:1_!OE!) L17.4(C:7_GND) L17.10(C:1_GND) L17.15(C:2_GND) L17.21(C:3_GND) L17.24(B:2_!OE!) L17.28(C:4_GND) L17.34(C:5_GND) L17.39(C:6_GND) L17.45(C:8_GND) L18.1(A:1_!OE!) L18.4(C:7_GND) L18.10(C:1_GND) L18.15(C:2_GND) L18.21(C:3_GND) L18.24(B:2_!OE!) L18.28(C:4_GND) L18.34(C:5_GND) L18.39(C:6_GND) L18.45(C:8_GND) L19.1(A:1_!OE!) L19.4(C:7_GND) L19.10(C:1_GND) L19.15(C:2_GND) L19.21(C:3_GND) L19.24(B:2_!OE!) L19.28(C:4_GND) L19.34(C:5_GND) L19.39(C:6_GND) L19.45(C:8_GND) L20.1(A:1_!OE!) L20.4(C:7_GND) L20.10(C:1_GND) L20.15(C:2_GND) L20.21(C:3_GND) L20.24(B:2_!OE!) L20.28(C:4_GND) L20.34(C:5_GND) L20.39(C:6_GND) L20.45(C:8_GND) L21.1(A:1_!OE!) L21.4(C:7_GND) L21.10(C:1_GND) L21.15(C:2_GND) L21.21(C:3_GND) L21.24(B:2_!OE!) L21.28(C:4_GND) L21.34(C:5_GND) L21.39(C:6_GND) L21.45(C:8_GND) L22.1(A:1_!OE!) L22.4(C:7_GND) L22.10(C:1_GND) L22.15(C:2_GND) L22.21(C:3_GND) L22.24(B:2_!OE!) L22.28(C:4_GND) L22.34(C:5_GND) L22.39(C:6_GND) L22.45(C:8_GND) L23.1(A:1_!OE!) L23.4(C:7_GND) L23.10(C:1_GND) L23.15(C:2_GND) L23.21(C:3_GND) L23.24(B:2_!OE!) L23.28(C:4_GND) L23.34(C:5_GND) L23.39(C:6_GND) L23.45(C:8_GND) L24.1(A:1_!OE!) L24.4(C:7_GND) L24.10(C:1_GND) L24.15(C:2_GND) L24.21(C:3_GND) L24.24(B:2_!OE!) L24.28(C:4_GND) L24.34(C:5_GND) L24.39(C:6_GND) L24.45(C:8_GND) L25.1(A:1_!OE!) L25.4(C:7_GND) L25.10(C:1_GND) L25.15(C:2_GND) L25.21(C:3_GND) L25.24(B:2_!OE!) L25.28(C:4_GND) L25.34(C:5_GND) L25.39(C:6_GND) L25.45(C:8_GND) POWER_JP1.3 POWER_JP2.3 POWER_JP3.3 POWER_JP4.3 SR1.8(GND) SR1.13(!OE) SR2.8(GND) SR2.13(!OE) SR3.8(GND) SR3.13(!OE) SR4.8(GND) SR4.13(!OE) SR5.8(GND) SR5.13(!OE) SR6.8(GND) SR6.13(!OE) SR7.8(GND) SR7.13(!OE) SR8.8(GND) SR8.13(!OE) SR9.8(GND) SR9.13(!OE) SR10.8(GND) SR10.13(!OE) SR11.8(GND) SR11.13(!OE) SR12.8(GND) SR12.13(!OE) SR13.8(GND) SR13.13(!OE) SR14.8(GND) SR14.13(!OE) SR15.8(GND) SR15.13(!OE) SR16.8(GND) SR16.13(!OE) SR17.8(GND) SR17.13(!OE) SR18.8(GND) SR18.13(!OE) SR19.8(GND) SR19.13(!OE) SR20.8(GND) SR20.13(!OE) SR21.8(GND) SR21.13(!OE) SR22.8(GND) SR22.13(!OE) SR23.8(GND) SR23.13(!OE) SR24.8(GND) SR24.13(!OE) SR25.8(GND) SR25.13(!OE)
LATCH_CLK1: IN_JP1.1 LATCH1-2.2 OUT_JP1.1 SR1.12(RCLK) SR2.12(RCLK) SR3.12(RCLK) SR4.12(RCLK) SR5.12(RCLK)
LATCH_CLK2: IN_JP2.1 LATCH1-2.1 LATCH2-3.2 OUT_JP2.1 SR6.12(RCLK) SR7.12(RCLK) SR8.12(RCLK) SR9.12(RCLK) SR10.12(RCLK)
LATCH_CLK3: IN_JP3.1 LATCH2-3.1 LATCH3-4.2 OUT_JP3.1 SR11.12(RCLK) SR12.12(RCLK) SR13.12(RCLK) SR14.12(RCLK) SR15.12(RCLK)
LATCH_CLK4: IN_JP4.1 LATCH3-4.1 LATCH4-5.2 OUT_JP4.1 SR16.12(RCLK) SR17.12(RCLK) SR18.12(RCLK) SR19.12(RCLK) SR20.12(RCLK)
LATCH_CLK5: IN_JP5.1 LATCH4-5.1 OUT_JP5.1 SR21.12(RCLK) SR22.12(RCLK) SR23.12(RCLK) SR24.12(RCLK) SR25.12(RCLK)
N$1: SR1.9(QH') SR2.14(SER)
N$2: SR4.9(QH') SR5.14(SER)
N$3: SR6.9(QH') SR7.14(SER)
N$4: SR7.9(QH') SR8.14(SER)
N$5: SR8.9(QH') SR9.14(SER)
N$6: SR9.9(QH') SR10.14(SER)
N$7: SR11.9(QH') SR12.14(SER)
N$8: SR2.9(QH') SR3.14(SER)
N$9: SR12.9(QH') SR13.14(SER)
N$10: SR13.9(QH') SR14.14(SER)
N$12: SR14.9(QH') SR15.14(SER)
N$13: SR16.9(QH') SR17.14(SER)
N$14: SR17.9(QH') SR18.14(SER)
N$15: SR3.9(QH') SR4.14(SER)
N$16: SR18.9(QH') SR19.14(SER)
N$17: SR19.9(QH') SR20.14(SER)
N$18: SR21.9(QH') SR22.14(SER)
N$19: SR22.9(QH') SR23.14(SER)
N$21: SR23.9(QH') SR24.14(SER)
N$22: SR24.9(QH') SR25.14(SER)
SR_OUT1_1: L1.36(B:2D1) L1.47(A:1D1) SR1.15(QA)
SR_OUT1_2: L1.35(B:2D2) L1.46(A:1D2) SR1.1(QB)
SR_OUT1_3: L1.33(B:2D3) L1.44(A:1D3) SR1.2(QC)
SR_OUT1_4: L1.32(B:2D4) L1.43(A:1D4) SR1.3(QD)
SR_OUT1_5: L1.30(B:2D5) L1.41(A:1D5) SR1.4(QE)
SR_OUT1_6: L1.29(B:2D6) L1.40(A:1D6) SR1.5(QF)
SR_OUT1_7: L1.27(B:2D7) L1.38(A:1D7) SR1.6(QG)
SR_OUT1_8: L1.26(B:2D8) L1.37(A:1D8) SR1.7(QH)
SR_OUT2_1: L2.36(B:2D1) L2.47(A:1D1) SR2.15(QA)
SR_OUT2_2: L2.35(B:2D2) L2.46(A:1D2) SR2.1(QB)
SR_OUT2_3: L2.33(B:2D3) L2.44(A:1D3) SR2.2(QC)
SR_OUT2_4: L2.32(B:2D4) L2.43(A:1D4) SR2.3(QD)
SR_OUT2_5: L2.30(B:2D5) L2.41(A:1D5) SR2.4(QE)
SR_OUT2_6: L2.29(B:2D6) L2.40(A:1D6) SR2.5(QF)
SR_OUT2_7: L2.27(B:2D7) L2.38(A:1D7) SR2.6(QG)
SR_OUT2_8: L2.26(B:2D8) L2.37(A:1D8) SR2.7(QH)
SR_OUT3_1: L3.36(B:2D1) L3.47(A:1D1) SR3.15(QA)
SR_OUT3_2: L3.35(B:2D2) L3.46(A:1D2) SR3.1(QB)
SR_OUT3_3: L3.33(B:2D3) L3.44(A:1D3) SR3.2(QC)
SR_OUT3_4: L3.32(B:2D4) L3.43(A:1D4) SR3.3(QD)
SR_OUT3_5: L3.30(B:2D5) L3.41(A:1D5) SR3.4(QE)
SR_OUT3_6: L3.29(B:2D6) L3.40(A:1D6) SR3.5(QF)
SR_OUT3_7: L3.27(B:2D7) L3.38(A:1D7) SR3.6(QG)
SR_OUT3_8: L3.26(B:2D8) L3.37(A:1D8) SR3.7(QH)
SR_OUT4_1: L4.36(B:2D1) L4.47(A:1D1) SR4.15(QA)
SR_OUT4_2: L4.35(B:2D2) L4.46(A:1D2) SR4.1(QB)
SR_OUT4_3: L4.33(B:2D3) L4.44(A:1D3) SR4.2(QC)
SR_OUT4_4: L4.32(B:2D4) L4.43(A:1D4) SR4.3(QD)
SR_OUT4_5: L4.30(B:2D5) L4.41(A:1D5) SR4.4(QE)
SR_OUT4_6: L4.29(B:2D6) L4.40(A:1D6) SR4.5(QF)
SR_OUT4_7: L4.27(B:2D7) L4.38(A:1D7) SR4.6(QG)
SR_OUT4_8: L4.26(B:2D8) L4.37(A:1D8) SR4.7(QH)
SR_OUT5_1: L5.36(B:2D1) L5.47(A:1D1) SR5.15(QA)
SR_OUT5_2: L5.35(B:2D2) L5.46(A:1D2) SR5.1(QB)
SR_OUT5_3: L5.33(B:2D3) L5.44(A:1D3) SR5.2(QC)
SR_OUT5_4: L5.32(B:2D4) L5.43(A:1D4) SR5.3(QD)
SR_OUT5_5: L5.30(B:2D5) L5.41(A:1D5) SR5.4(QE)
SR_OUT5_6: L5.29(B:2D6) L5.40(A:1D6) SR5.5(QF)
SR_OUT5_7: L5.27(B:2D7) L5.38(A:1D7) SR5.6(QG)
SR_OUT5_8: L5.26(B:2D8) L5.37(A:1D8) SR5.7(QH)
SR_OUT6_1: L6.36(B:2D1) L6.47(A:1D1) SR6.15(QA)
SR_OUT6_2: L6.35(B:2D2) L6.46(A:1D2) SR6.1(QB)
SR_OUT6_3: L6.33(B:2D3) L6.44(A:1D3) SR6.2(QC)
SR_OUT6_4: L6.32(B:2D4) L6.43(A:1D4) SR6.3(QD)
SR_OUT6_5: L6.30(B:2D5) L6.41(A:1D5) SR6.4(QE)
SR_OUT6_6: L6.29(B:2D6) L6.40(A:1D6) SR6.5(QF)
SR_OUT6_7: L6.27(B:2D7) L6.38(A:1D7) SR6.6(QG)
SR_OUT6_8: L6.26(B:2D8) L6.37(A:1D8) SR6.7(QH)
SR_OUT7_1: L7.36(B:2D1) L7.47(A:1D1) SR7.15(QA)
SR_OUT7_2: L7.35(B:2D2) L7.46(A:1D2) SR7.1(QB)
SR_OUT7_3: L7.33(B:2D3) L7.44(A:1D3) SR7.2(QC)
SR_OUT7_4: L7.32(B:2D4) L7.43(A:1D4) SR7.3(QD)
SR_OUT7_5: L7.30(B:2D5) L7.41(A:1D5) SR7.4(QE)
SR_OUT7_6: L7.29(B:2D6) L7.40(A:1D6) SR7.5(QF)
SR_OUT7_7: L7.27(B:2D7) L7.38(A:1D7) SR7.6(QG)
SR_OUT7_8: L7.26(B:2D8) L7.37(A:1D8) SR7.7(QH)
SR_OUT8_1: L8.36(B:2D1) L8.47(A:1D1) SR8.15(QA)
SR_OUT8_2: L8.35(B:2D2) L8.46(A:1D2) SR8.1(QB)
SR_OUT8_3: L8.33(B:2D3) L8.44(A:1D3) SR8.2(QC)
SR_OUT8_4: L8.32(B:2D4) L8.43(A:1D4) SR8.3(QD)
SR_OUT8_5: L8.30(B:2D5) L8.41(A:1D5) SR8.4(QE)
SR_OUT8_6: L8.29(B:2D6) L8.40(A:1D6) SR8.5(QF)
SR_OUT8_7: L8.27(B:2D7) L8.38(A:1D7) SR8.6(QG)
SR_OUT8_8: L8.26(B:2D8) L8.37(A:1D8) SR8.7(QH)
SR_OUT9_1: L9.36(B:2D1) L9.47(A:1D1) SR9.15(QA)
SR_OUT9_2: L9.35(B:2D2) L9.46(A:1D2) SR9.1(QB)
SR_OUT9_3: L9.33(B:2D3) L9.44(A:1D3) SR9.2(QC)
SR_OUT9_4: L9.32(B:2D4) L9.43(A:1D4) SR9.3(QD)
SR_OUT9_5: L9.30(B:2D5) L9.41(A:1D5) SR9.4(QE)
SR_OUT9_6: L9.29(B:2D6) L9.40(A:1D6) SR9.5(QF)
SR_OUT9_7: L9.27(B:2D7) L9.38(A:1D7) SR9.6(QG)
SR_OUT9_8: L9.26(B:2D8) L9.37(A:1D8) SR9.7(QH)
SR_OUT10_1: L10.36(B:2D1) L10.47(A:1D1) SR10.15(QA)
SR_OUT10_2: L10.35(B:2D2) L10.46(A:1D2) SR10.1(QB)
SR_OUT10_3: L10.33(B:2D3) L10.44(A:1D3) SR10.2(QC)
SR_OUT10_4: L10.32(B:2D4) L10.43(A:1D4) SR10.3(QD)
SR_OUT10_5: L10.30(B:2D5) L10.41(A:1D5) SR10.4(QE)
SR_OUT10_6: L10.29(B:2D6) L10.40(A:1D6) SR10.5(QF)
SR_OUT10_7: L10.27(B:2D7) L10.38(A:1D7) SR10.6(QG)
SR_OUT10_8: L10.26(B:2D8) L10.37(A:1D8) SR10.7(QH)
SR_OUT11_1: L11.36(B:2D1) L11.47(A:1D1) SR11.15(QA)
SR_OUT11_2: L11.35(B:2D2) L11.46(A:1D2) SR11.1(QB)
SR_OUT11_3: L11.33(B:2D3) L11.44(A:1D3) SR11.2(QC)
SR_OUT11_4: L11.32(B:2D4) L11.43(A:1D4) SR11.3(QD)
SR_OUT11_5: L11.30(B:2D5) L11.41(A:1D5) SR11.4(QE)
SR_OUT11_6: L11.29(B:2D6) L11.40(A:1D6) SR11.5(QF)
SR_OUT11_7: L11.27(B:2D7) L11.38(A:1D7) SR11.6(QG)
SR_OUT11_8: L11.26(B:2D8) L11.37(A:1D8) SR11.7(QH)
SR_OUT12_1: L12.36(B:2D1) L12.47(A:1D1) SR12.15(QA)
SR_OUT12_2: L12.35(B:2D2) L12.46(A:1D2) SR12.1(QB)
SR_OUT12_3: L12.33(B:2D3) L12.44(A:1D3) SR12.2(QC)
SR_OUT12_4: L12.32(B:2D4) L12.43(A:1D4) SR12.3(QD)
SR_OUT12_5: L12.30(B:2D5) L12.41(A:1D5) SR12.4(QE)
SR_OUT12_6: L12.29(B:2D6) L12.40(A:1D6) SR12.5(QF)
SR_OUT12_7: L12.27(B:2D7) L12.38(A:1D7) SR12.6(QG)
SR_OUT12_8: L12.26(B:2D8) L12.37(A:1D8) SR12.7(QH)
SR_OUT13_1: L13.36(B:2D1) L13.47(A:1D1) SR13.15(QA)
SR_OUT13_2: L13.35(B:2D2) L13.46(A:1D2) SR13.1(QB)
SR_OUT13_3: L13.33(B:2D3) L13.44(A:1D3) SR13.2(QC)
SR_OUT13_4: L13.32(B:2D4) L13.43(A:1D4) SR13.3(QD)
SR_OUT13_5: L13.30(B:2D5) L13.41(A:1D5) SR13.4(QE)
SR_OUT13_6: L13.29(B:2D6) L13.40(A:1D6) SR13.5(QF)
SR_OUT13_7: L13.27(B:2D7) L13.38(A:1D7) SR13.6(QG)
SR_OUT13_8: L13.26(B:2D8) L13.37(A:1D8) SR13.7(QH)
SR_OUT14_1: L14.36(B:2D1) L14.47(A:1D1) SR14.15(QA)
SR_OUT14_2: L14.35(B:2D2) L14.46(A:1D2) SR14.1(QB)
SR_OUT14_3: L14.33(B:2D3) L14.44(A:1D3) SR14.2(QC)
SR_OUT14_4: L14.32(B:2D4) L14.43(A:1D4) SR14.3(QD)
SR_OUT14_5: L14.30(B:2D5) L14.41(A:1D5) SR14.4(QE)
SR_OUT14_6: L14.29(B:2D6) L14.40(A:1D6) SR14.5(QF)
SR_OUT14_7: L14.27(B:2D7) L14.38(A:1D7) SR14.6(QG)
SR_OUT14_8: L14.26(B:2D8) L14.37(A:1D8) SR14.7(QH)
SR_OUT15_1: L15.36(B:2D1) L15.47(A:1D1) SR15.15(QA)
SR_OUT15_2: L15.35(B:2D2) L15.46(A:1D2) SR15.1(QB)
SR_OUT15_3: L15.33(B:2D3) L15.44(A:1D3) SR15.2(QC)
SR_OUT15_4: L15.32(B:2D4) L15.43(A:1D4) SR15.3(QD)
SR_OUT15_5: L15.30(B:2D5) L15.41(A:1D5) SR15.4(QE)
SR_OUT15_6: L15.29(B:2D6) L15.40(A:1D6) SR15.5(QF)
SR_OUT15_7: L15.27(B:2D7) L15.38(A:1D7) SR15.6(QG)
SR_OUT15_8: L15.26(B:2D8) L15.37(A:1D8) SR15.7(QH)
SR_OUT16_1: L16.36(B:2D1) L16.47(A:1D1) SR16.15(QA)
SR_OUT16_2: L16.35(B:2D2) L16.46(A:1D2) SR16.1(QB)
SR_OUT16_3: L16.33(B:2D3) L16.44(A:1D3) SR16.2(QC)
SR_OUT16_4: L16.32(B:2D4) L16.43(A:1D4) SR16.3(QD)
SR_OUT16_5: L16.30(B:2D5) L16.41(A:1D5) SR16.4(QE)
SR_OUT16_6: L16.29(B:2D6) L16.40(A:1D6) SR16.5(QF)
SR_OUT16_7: L16.27(B:2D7) L16.38(A:1D7) SR16.6(QG)
SR_OUT16_8: L16.26(B:2D8) L16.37(A:1D8) SR16.7(QH)
SR_OUT17_1: L17.36(B:2D1) L17.47(A:1D1) SR17.15(QA)
SR_OUT17_2: L17.35(B:2D2) L17.46(A:1D2) SR17.1(QB)
SR_OUT17_3: L17.33(B:2D3) L17.44(A:1D3) SR17.2(QC)
SR_OUT17_4: L17.32(B:2D4) L17.43(A:1D4) SR17.3(QD)
SR_OUT17_5: L17.30(B:2D5) L17.41(A:1D5) SR17.4(QE)
SR_OUT17_6: L17.29(B:2D6) L17.40(A:1D6) SR17.5(QF)
SR_OUT17_7: L17.27(B:2D7) L17.38(A:1D7) SR17.6(QG)
SR_OUT17_8: L17.26(B:2D8) L17.37(A:1D8) SR17.7(QH)
SR_OUT18_1: L18.36(B:2D1) L18.47(A:1D1) SR18.15(QA)
SR_OUT18_2: L18.35(B:2D2) L18.46(A:1D2) SR18.1(QB)
SR_OUT18_3: L18.33(B:2D3) L18.44(A:1D3) SR18.2(QC)
SR_OUT18_4: L18.32(B:2D4) L18.43(A:1D4) SR18.3(QD)
SR_OUT18_5: L18.30(B:2D5) L18.41(A:1D5) SR18.4(QE)
SR_OUT18_6: L18.29(B:2D6) L18.40(A:1D6) SR18.5(QF)
SR_OUT18_7: L18.27(B:2D7) L18.38(A:1D7) SR18.6(QG)
SR_OUT18_8: L18.26(B:2D8) L18.37(A:1D8) SR18.7(QH)
SR_OUT19_1: L19.36(B:2D1) L19.47(A:1D1) SR19.15(QA)
SR_OUT19_2: L19.35(B:2D2) L19.46(A:1D2) SR19.1(QB)
SR_OUT19_3: L19.33(B:2D3) L19.44(A:1D3) SR19.2(QC)
SR_OUT19_4: L19.32(B:2D4) L19.43(A:1D4) SR19.3(QD)
SR_OUT19_5: L19.30(B:2D5) L19.41(A:1D5) SR19.4(QE)
SR_OUT19_6: L19.29(B:2D6) L19.40(A:1D6) SR19.5(QF)
SR_OUT19_7: L19.27(B:2D7) L19.38(A:1D7) SR19.6(QG)
SR_OUT19_8: L19.26(B:2D8) L19.37(A:1D8) SR19.7(QH)
SR_OUT20_1: L20.36(B:2D1) L20.47(A:1D1) SR20.15(QA)
SR_OUT20_2: L20.35(B:2D2) L20.46(A:1D2) SR20.1(QB)
SR_OUT20_3: L20.33(B:2D3) L20.44(A:1D3) SR20.2(QC)
SR_OUT20_4: L20.32(B:2D4) L20.43(A:1D4) SR20.3(QD)
SR_OUT20_5: L20.30(B:2D5) L20.41(A:1D5) SR20.4(QE)
SR_OUT20_6: L20.29(B:2D6) L20.40(A:1D6) SR20.5(QF)
SR_OUT20_7: L20.27(B:2D7) L20.38(A:1D7) SR20.6(QG)
SR_OUT20_8: L20.26(B:2D8) L20.37(A:1D8) SR20.7(QH)
SR_OUT21_1: L21.36(B:2D1) L21.47(A:1D1) SR21.15(QA)
SR_OUT21_2: L21.35(B:2D2) L21.46(A:1D2) SR21.1(QB)
SR_OUT21_3: L21.33(B:2D3) L21.44(A:1D3) SR21.2(QC)
SR_OUT21_4: L21.32(B:2D4) L21.43(A:1D4) SR21.3(QD)
SR_OUT21_5: L21.30(B:2D5) L21.41(A:1D5) SR21.4(QE)
SR_OUT21_6: L21.29(B:2D6) L21.40(A:1D6) SR21.5(QF)
SR_OUT21_7: L21.27(B:2D7) L21.38(A:1D7) SR21.6(QG)
SR_OUT21_8: L21.26(B:2D8) L21.37(A:1D8) SR21.7(QH)
SR_OUT22_1: L22.36(B:2D1) L22.47(A:1D1) SR22.15(QA)
SR_OUT22_2: L22.35(B:2D2) L22.46(A:1D2) SR22.1(QB)
SR_OUT22_3: L22.33(B:2D3) L22.44(A:1D3) SR22.2(QC)
SR_OUT22_4: L22.32(B:2D4) L22.43(A:1D4) SR22.3(QD)
SR_OUT22_5: L22.30(B:2D5) L22.41(A:1D5) SR22.4(QE)
SR_OUT22_6: L22.29(B:2D6) L22.40(A:1D6) SR22.5(QF)
SR_OUT22_7: L22.27(B:2D7) L22.38(A:1D7) SR22.6(QG)
SR_OUT22_8: L22.26(B:2D8) L22.37(A:1D8) SR22.7(QH)
SR_OUT23_1: L23.36(B:2D1) L23.47(A:1D1) SR23.15(QA)
SR_OUT23_2: L23.35(B:2D2) L23.46(A:1D2) SR23.1(QB)
SR_OUT23_3: L23.33(B:2D3) L23.44(A:1D3) SR23.2(QC)
SR_OUT23_4: L23.32(B:2D4) L23.43(A:1D4) SR23.3(QD)
SR_OUT23_5: L23.30(B:2D5) L23.41(A:1D5) SR23.4(QE)
SR_OUT23_6: L23.29(B:2D6) L23.40(A:1D6) SR23.5(QF)
SR_OUT23_7: L23.27(B:2D7) L23.38(A:1D7) SR23.6(QG)
SR_OUT23_8: L23.26(B:2D8) L23.37(A:1D8) SR23.7(QH)
SR_OUT24_1: L24.36(B:2D1) L24.47(A:1D1) SR24.15(QA)
SR_OUT24_2: L24.35(B:2D2) L24.46(A:1D2) SR24.1(QB)
SR_OUT24_3: L24.33(B:2D3) L24.44(A:1D3) SR24.2(QC)
SR_OUT24_4: L24.32(B:2D4) L24.43(A:1D4) SR24.3(QD)
SR_OUT24_5: L24.30(B:2D5) L24.41(A:1D5) SR24.4(QE)
SR_OUT24_6: L24.29(B:2D6) L24.40(A:1D6) SR24.5(QF)
SR_OUT24_7: L24.27(B:2D7) L24.38(A:1D7) SR24.6(QG)
SR_OUT24_8: L24.26(B:2D8) L24.37(A:1D8) SR24.7(QH)
SR_OUT25_1: L25.36(B:2D1) L25.47(A:1D1) SR25.15(QA)
SR_OUT25_2: L25.35(B:2D2) L25.46(A:1D2) SR25.1(QB)
SR_OUT25_3: L25.33(B:2D3) L25.44(A:1D3) SR25.2(QC)
SR_OUT25_4: L25.32(B:2D4) L25.43(A:1D4) SR25.3(QD)
SR_OUT25_5: L25.30(B:2D5) L25.41(A:1D5) SR25.4(QE)
SR_OUT25_6: L25.29(B:2D6) L25.40(A:1D6) SR25.5(QF)
SR_OUT25_7: L25.27(B:2D7) L25.38(A:1D7) SR25.6(QG)
SR_OUT25_8: L25.26(B:2D8) L25.37(A:1D8) SR25.7(QH)
VCC_LATCH: L1.7(C:4_VCC) L1.18(C:1_VCC) L1.31(C:2_VCC) L1.42(C:3_VCC) L2.7(C:4_VCC) L2.18(C:1_VCC) L2.31(C:2_VCC) L2.42(C:3_VCC) L3.7(C:4_VCC) L3.18(C:1_VCC) L3.31(C:2_VCC) L3.42(C:3_VCC) L4.7(C:4_VCC) L4.18(C:1_VCC) L4.31(C:2_VCC) L4.42(C:3_VCC) L5.7(C:4_VCC) L5.18(C:1_VCC) L5.31(C:2_VCC) L5.42(C:3_VCC) L6.7(C:4_VCC) L6.18(C:1_VCC) L6.31(C:2_VCC) L6.42(C:3_VCC) L7.7(C:4_VCC) L7.18(C:1_VCC) L7.31(C:2_VCC) L7.42(C:3_VCC) L8.7(C:4_VCC) L8.18(C:1_VCC) L8.31(C:2_VCC) L8.42(C:3_VCC) L9.7(C:4_VCC) L9.18(C:1_VCC) L9.31(C:2_VCC) L9.42(C:3_VCC) L10.7(C:4_VCC) L10.18(C:1_VCC) L10.31(C:2_VCC) L10.42(C:3_VCC) L11.7(C:4_VCC) L11.18(C:1_VCC) L11.31(C:2_VCC) L11.42(C:3_VCC) L12.7(C:4_VCC) L12.18(C:1_VCC) L12.31(C:2_VCC) L12.42(C:3_VCC) L13.7(C:4_VCC) L13.18(C:1_VCC) L13.31(C:2_VCC) L13.42(C:3_VCC) L14.7(C:4_VCC) L14.18(C:1_VCC) L14.31(C:2_VCC) L14.42(C:3_VCC) L15.7(C:4_VCC) L15.18(C:1_VCC) L15.31(C:2_VCC) L15.42(C:3_VCC) L16.7(C:4_VCC) L16.18(C:1_VCC) L16.31(C:2_VCC) L16.42(C:3_VCC) L17.7(C:4_VCC) L17.18(C:1_VCC) L17.31(C:2_VCC) L17.42(C:3_VCC) L18.7(C:4_VCC) L18.18(C:1_VCC) L18.31(C:2_VCC) L18.42(C:3_VCC) L19.7(C:4_VCC) L19.18(C:1_VCC) L19.31(C:2_VCC) L19.42(C:3_VCC) L20.7(C:4_VCC) L20.18(C:1_VCC) L20.31(C:2_VCC) L20.42(C:3_VCC) L21.7(C:4_VCC) L21.18(C:1_VCC) L21.31(C:2_VCC) L21.42(C:3_VCC) L22.7(C:4_VCC) L22.18(C:1_VCC) L22.31(C:2_VCC) L22.42(C:3_VCC) L23.7(C:4_VCC) L23.18(C:1_VCC) L23.31(C:2_VCC) L23.42(C:3_VCC) L24.7(C:4_VCC) L24.18(C:1_VCC) L24.31(C:2_VCC) L24.42(C:3_VCC) L25.7(C:4_VCC) L25.18(C:1_VCC) L25.31(C:2_VCC) L25.42(C:3_VCC) POWER_JP1.2 POWER_JP2.2 POWER_JP3.2 POWER_JP4.2
VCC_SR: POWER_JP1.1 POWER_JP2.1 POWER_JP3.1 POWER_JP4.1 SR1.10(!SCLR) SR1.16(VCC) SR2.10(!SCLR) SR2.16(VCC) SR3.10(!SCLR) SR3.16(VCC) SR4.10(!SCLR) SR4.16(VCC) SR5.10(!SCLR) SR5.16(VCC) SR6.10(!SCLR) SR6.16(VCC) SR7.10(!SCLR) SR7.16(VCC) SR8.10(!SCLR) SR8.16(VCC) SR9.10(!SCLR) SR9.16(VCC) SR10.10(!SCLR) SR10.16(VCC) SR11.10(!SCLR) SR11.16(VCC) SR12.10(!SCLR) SR12.16(VCC) SR13.10(!SCLR) SR13.16(VCC) SR14.10(!SCLR) SR14.16(VCC) SR15.10(!SCLR) SR15.16(VCC) SR16.10(!SCLR) SR16.16(VCC) SR17.10(!SCLR) SR17.16(VCC) SR18.10(!SCLR) SR18.16(VCC) SR19.10(!SCLR) SR19.16(VCC) SR20.10(!SCLR) SR20.16(VCC) SR21.10(!SCLR) SR21.16(VCC) SR22.10(!SCLR) SR22.16(VCC) SR23.10(!SCLR) SR23.16(VCC) SR24.10(!SCLR) SR24.16(VCC) SR25.10(!SCLR) SR25.16(VCC)

## Library data of the parts
CONNECTION_BETWEEN_SR5-6 CONNECTION_BETWEEN_SR10-11 CONNECTION_BETWEEN_SR15-16 CONNECTION_BETWEEN_SR20-21 LATCH1-2 LATCH2-3 LATCH3-4 LATCH4-5 = rcl:R-US_: RESISTOR, American symbol; SPICEPREFIX: R
EN_JP1 EN_JP2 = pinhead:PINHD-1X10: PIN HEADER
FPC1-FPC20 = con-hirose:FH12-20S-0.5S: 0.5mm Pitch Connectors For FPC/FFC Source: Data sheet <http://www.hirose.co.jp/cataloge_hp/e58605370.pdf>; MPN: FH12-20S-0.5SH(55); OC_FARNELL: 1324549; OC_NEWARK: 34M6166
IN_JP1-IN_JP5 OUT_JP1-OUT_JP5 = pinhead:PINHD-1X2: PIN HEADER
L1-L25 = SN74LVC16373A(NEW_16BIT_LATCH):TEXAS_INSTRUMENTS_SN74LVC16373A: TI-SN54_74XXXXX16X373X-48; 3_STATE_OUTPUT: Yes; BITS: 16; CIIVA_IDS: 19307467; CODE__JEDEC: MO-153; DATASHEET_VERSION: SCAS755B; FOOTPRINT_VARIANT_NAME_0: Level C; FOOTPRINT_VARIANT_NAME_1: Level B; FOOTPRINT_VARIANT_NAME_2: Level A; F__NOM_VOLTAGEMAXMHZ: 100; ICC__NOM_VOLTAGEMAXMA: 0.02; IMPORTED: yes; IMPORTED_FROM: vault; IMPORT_TS: 1521844253; INPUT_TYPE: CMOS,TTL; LOGIC: true; MF: Texas Instruments; MPN: SN74LVC16373A; OPERATING_TEMPERATURE_RANGEC: -40 to 125,-40 to 85; OUTPUT_DRIVE_IOLIOHMAXMA: 24/-24; OUTPUT_LOGIC: Non-inverted; OUTPUT_TYPE: CMOS; PACKAGE: DGG0048A; PREFIX: U; RATING: Catalog; RELEASE_DATE: 1459328133; SCHMITT_TRIGGER: No; STATIC_CURRENT: 0.02; TECHNOLOGY_FAMILY: LVC; TPD__NOM_VOLTAGEMAXNS: 6.4,4.2,4.9; VAULT_GUID: 00FB3570-8383-4C82-A038-A58A20934C8C; VAULT_REVISION: B0EE8CD6-9ACA-4FFF-ACFC-C0240CF4C59E; VCC_MAX_V: 3.6; VCC_MIN_V: 1.65; VOLTAGE_NOM_V: 1.8,2.5,2.7,3.3
POWER_JP1-POWER_JP4 = pinhead:PINHD-1X4: PIN HEADER
SR1-SR25 = 74HC595:74HC595: 8-bit SHIFT REGISTER, output latch Check availability <https://pricing.snapeda.com/parts/74HC595/Nexperia/view-part?ref=eda>; AVAILABILITY: In Stock; DESCRIPTION: Shift Register Single 8-Bit Serial to Serial/Parallel 16-Pin SSOP T/R; MF: Nexperia; MP: 74HC595; PACKAGE: None; PRICE: None